# EAGLE design synth-a-phone-v1.0 (EAGLE 5.11)
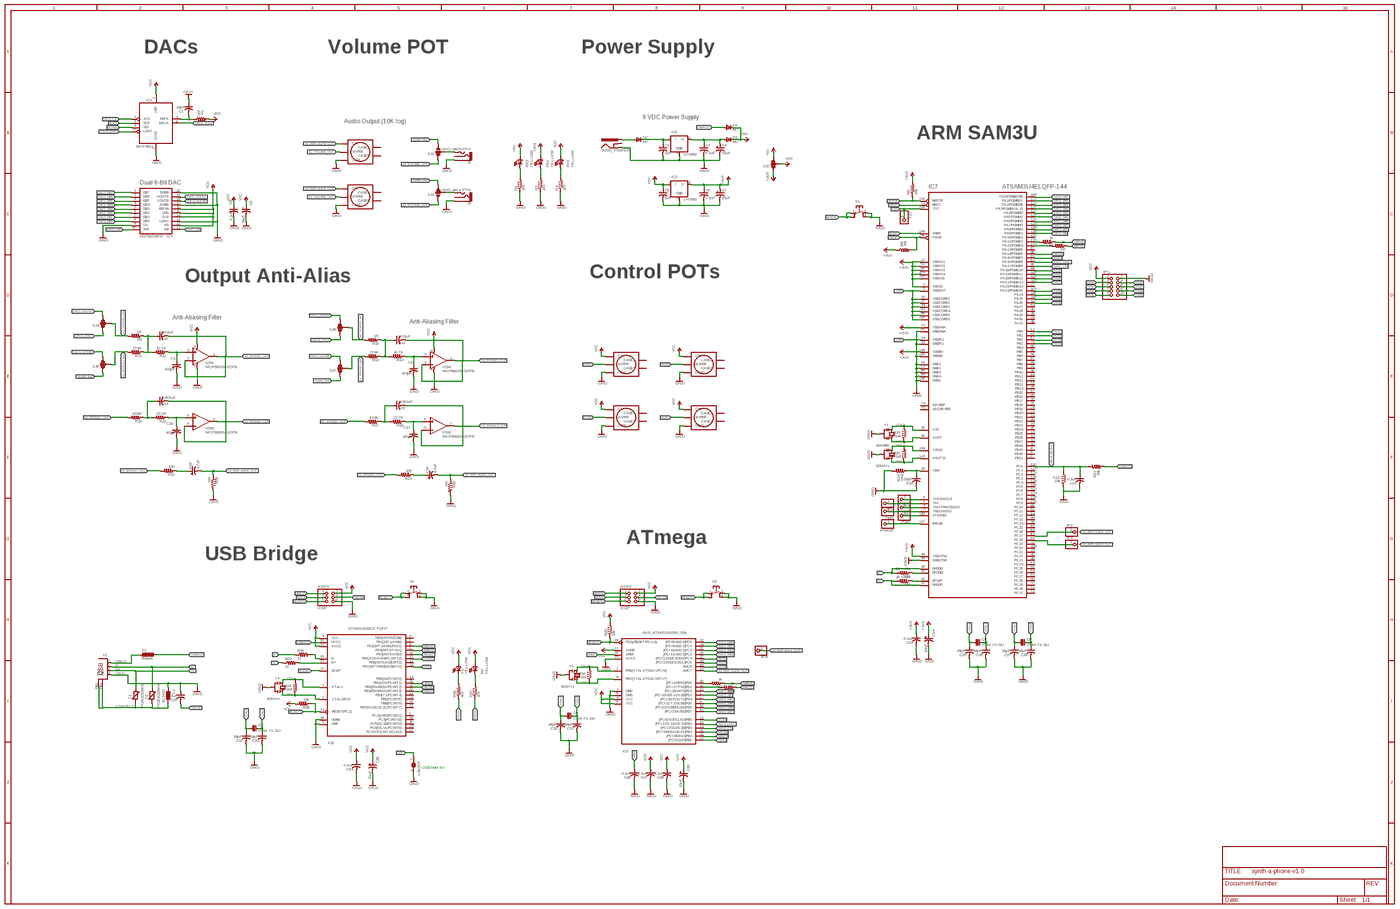
[diagram p0: schematic, sheet 1, overview]
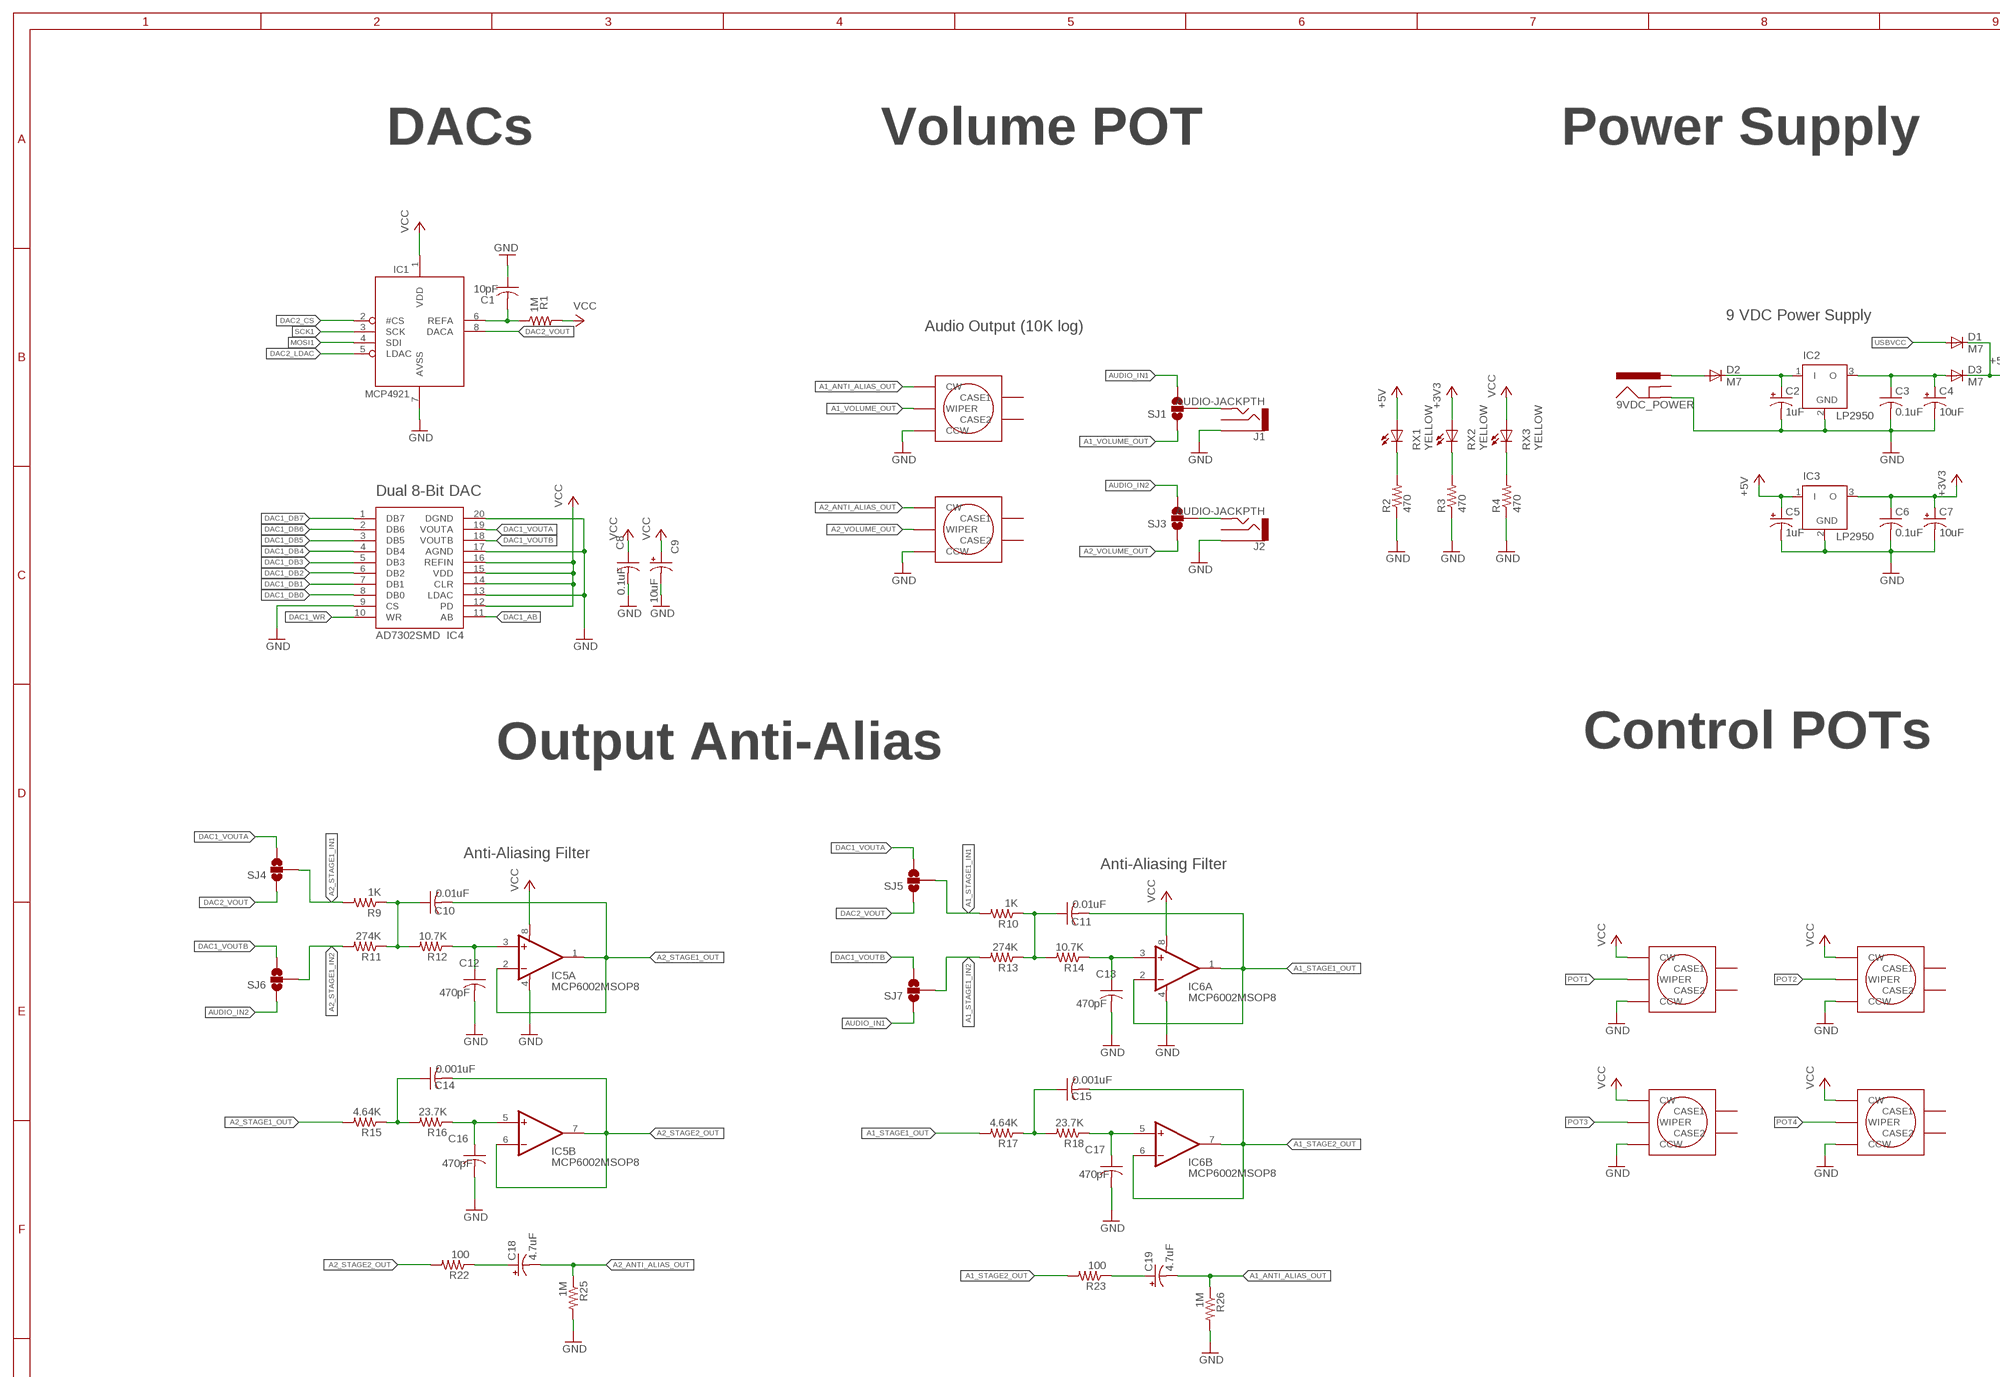
[diagram p1: schematic, sheet 1, part 1 of 4]
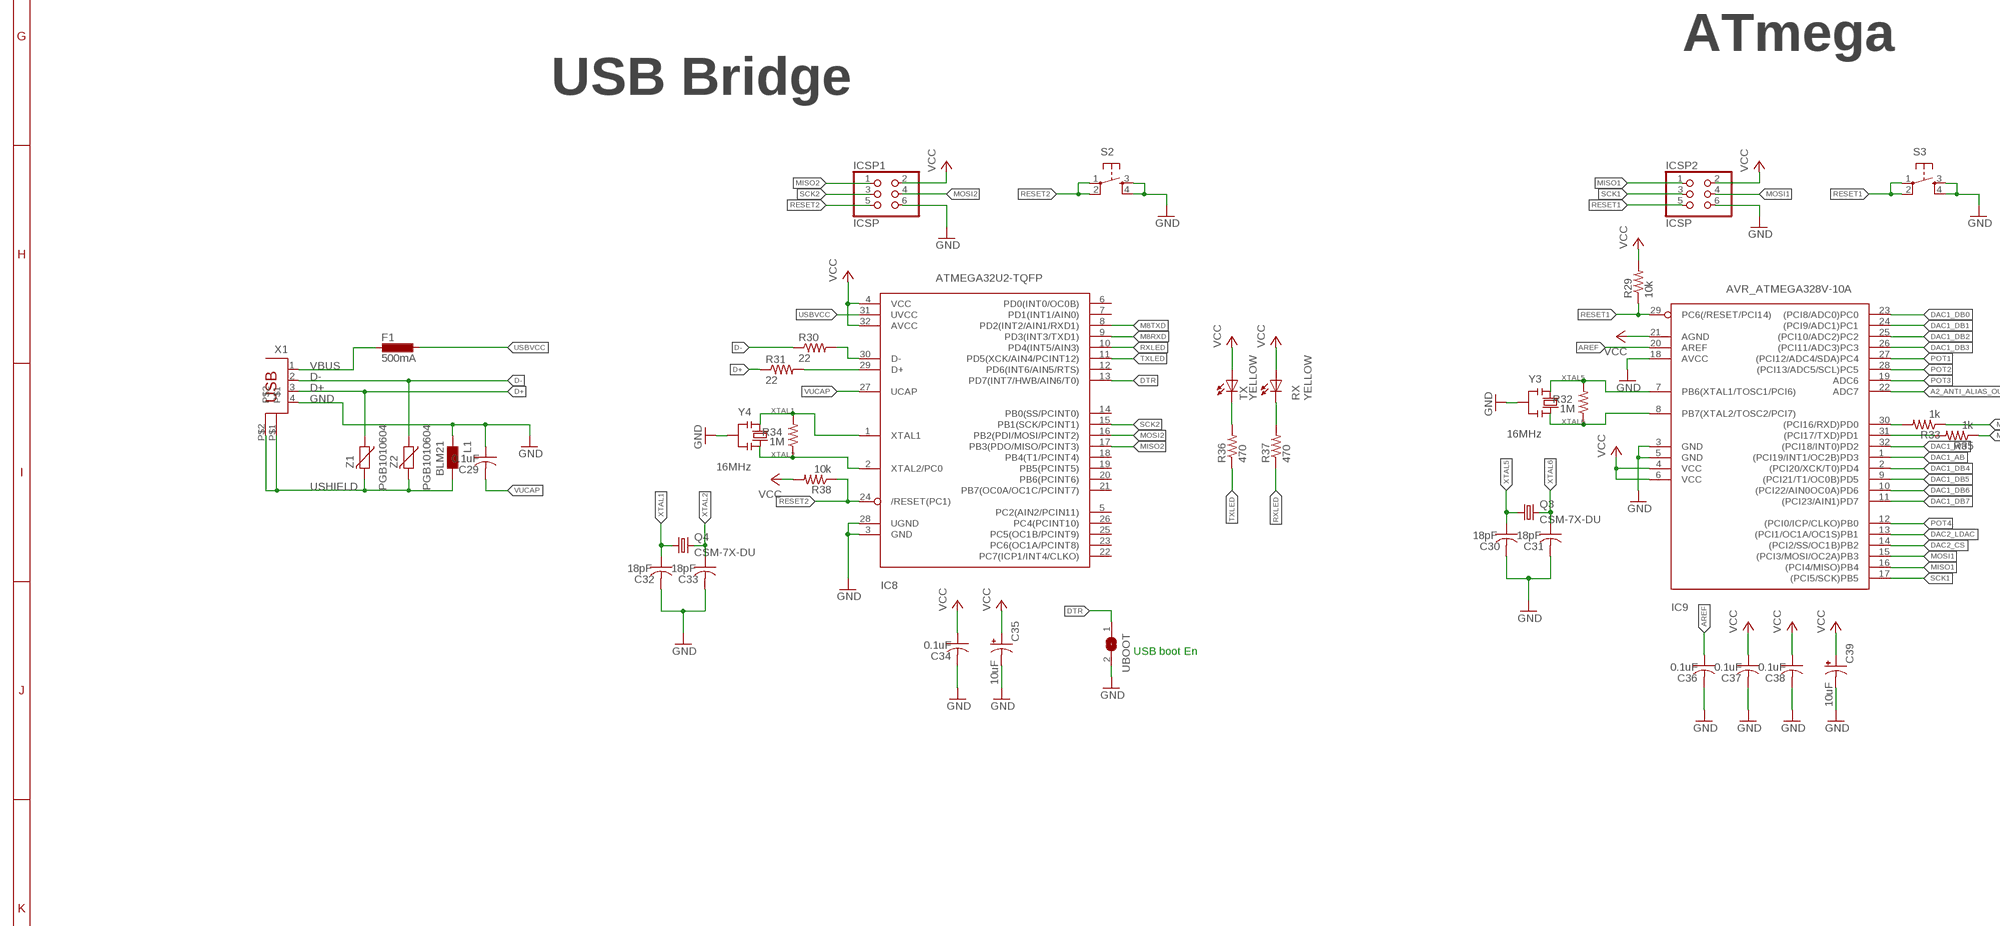
[diagram p2: schematic, sheet 1, part 2 of 4]
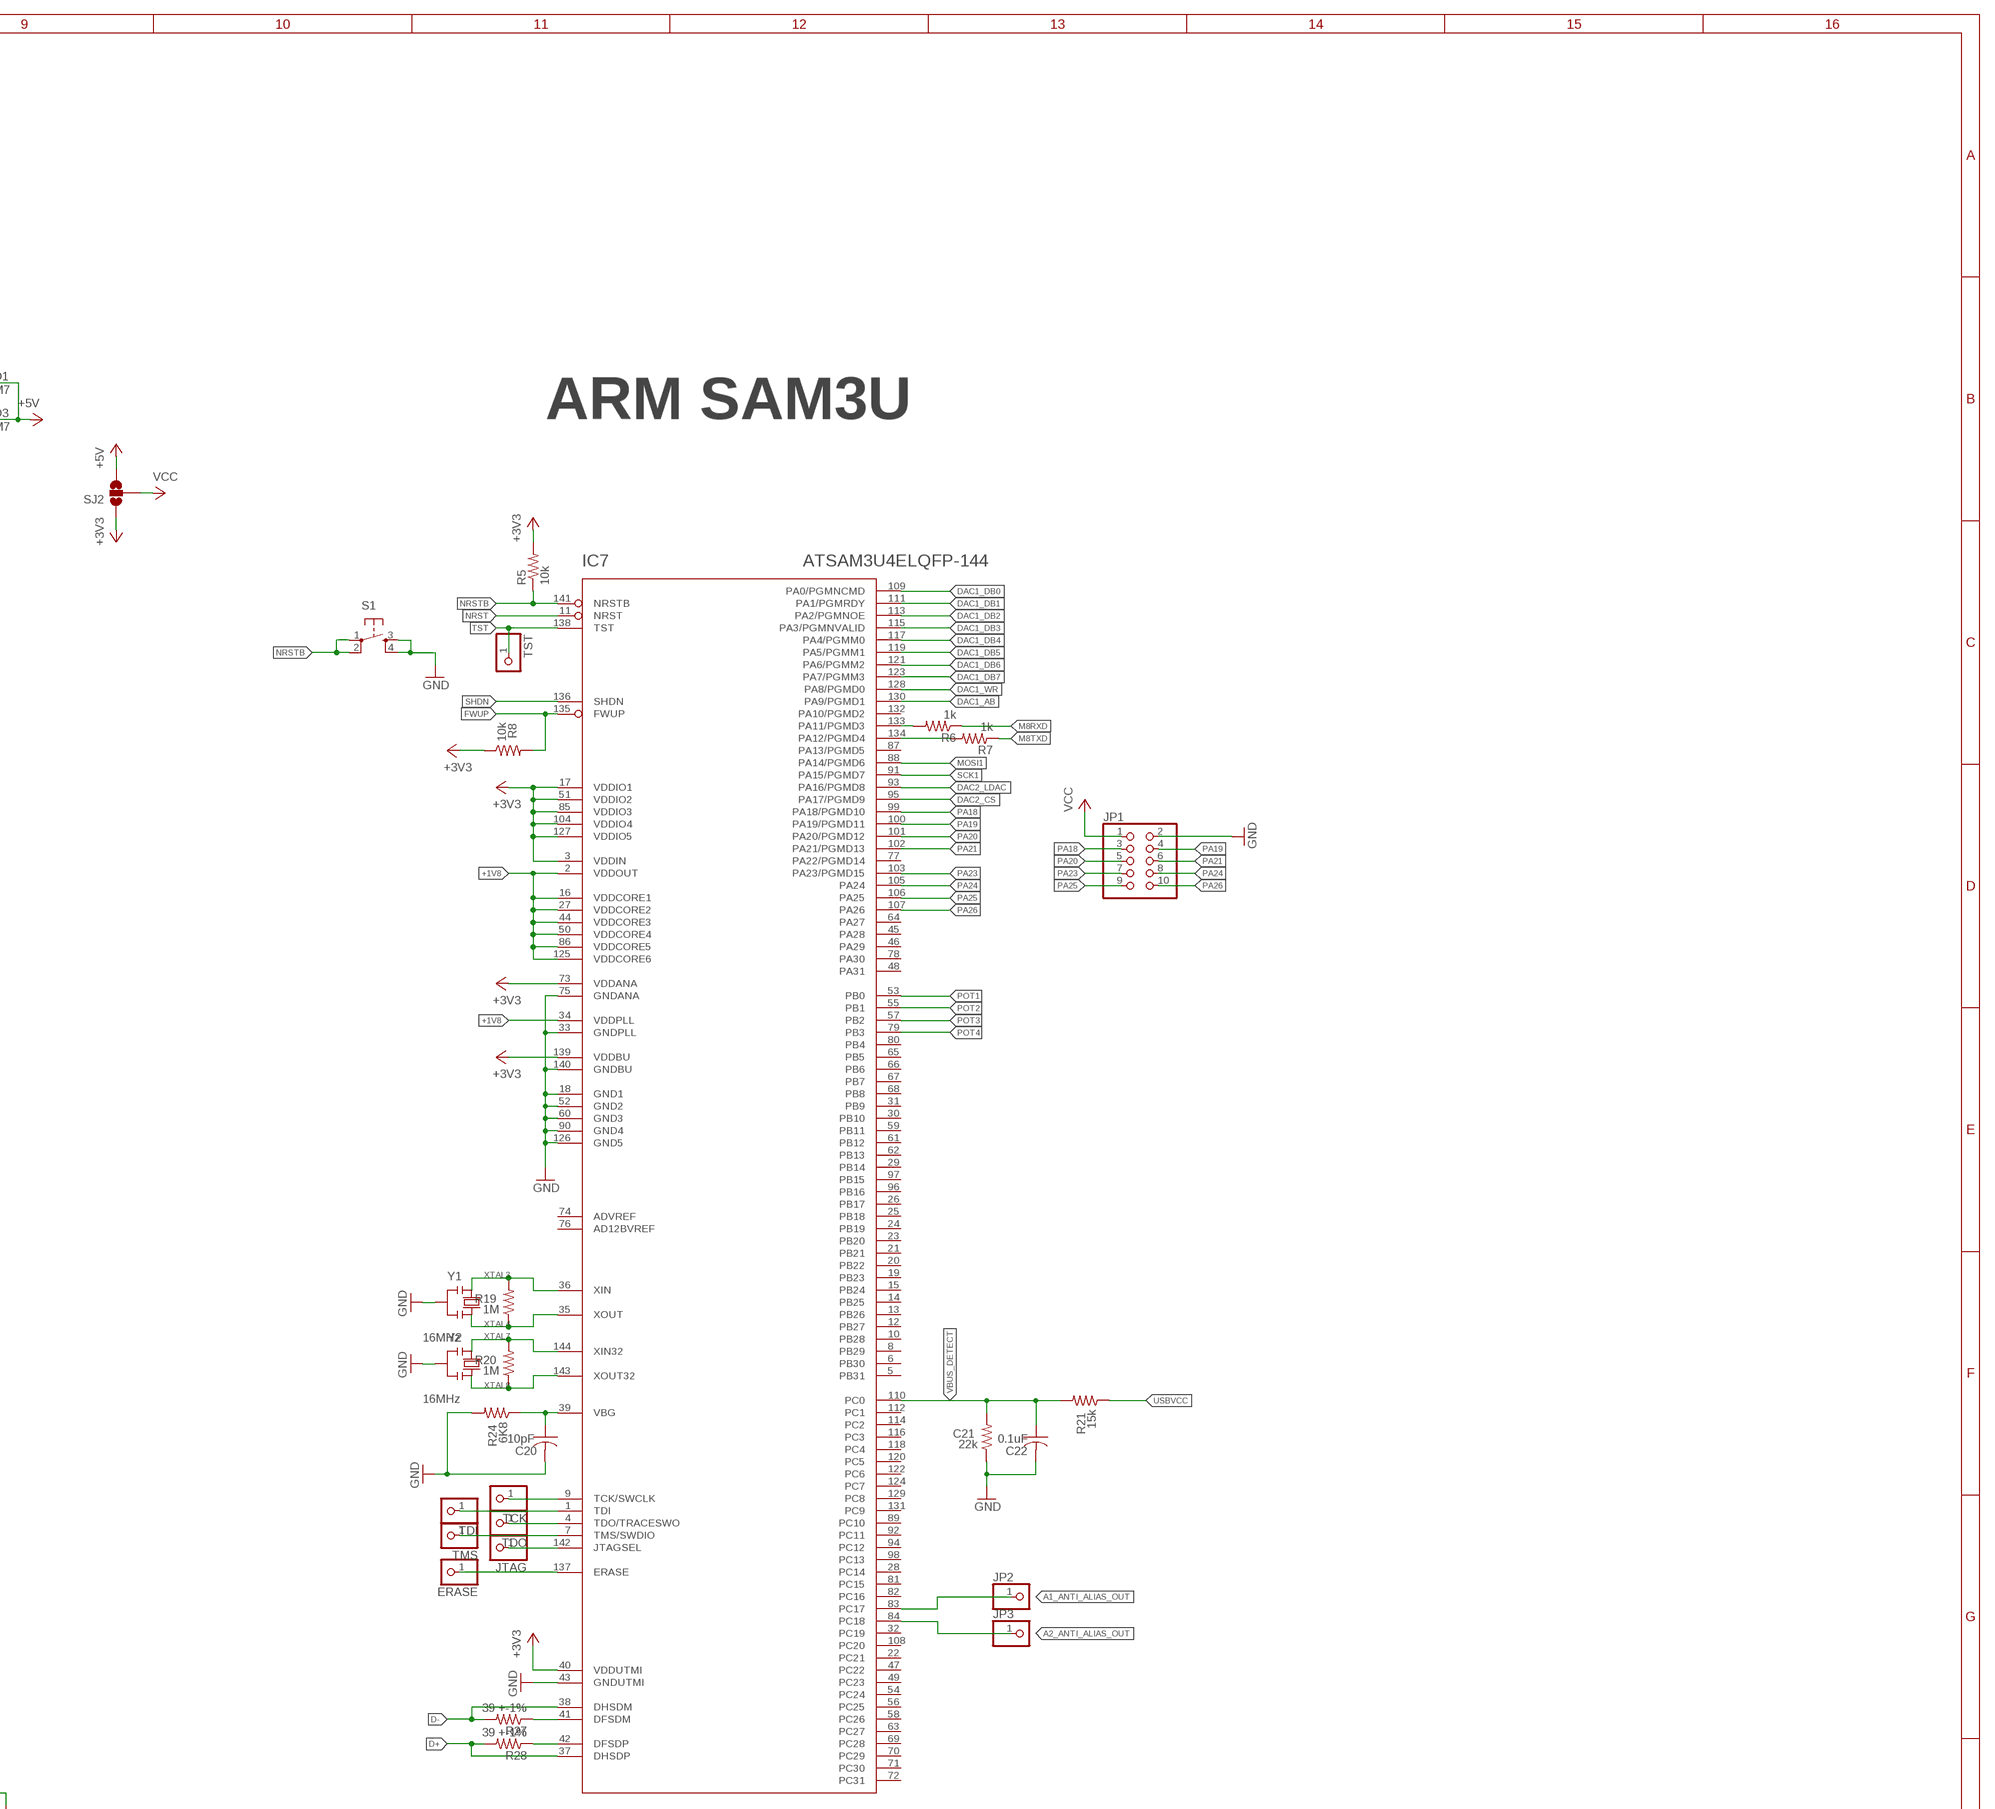
[diagram p3: schematic, sheet 1, part 3 of 4]
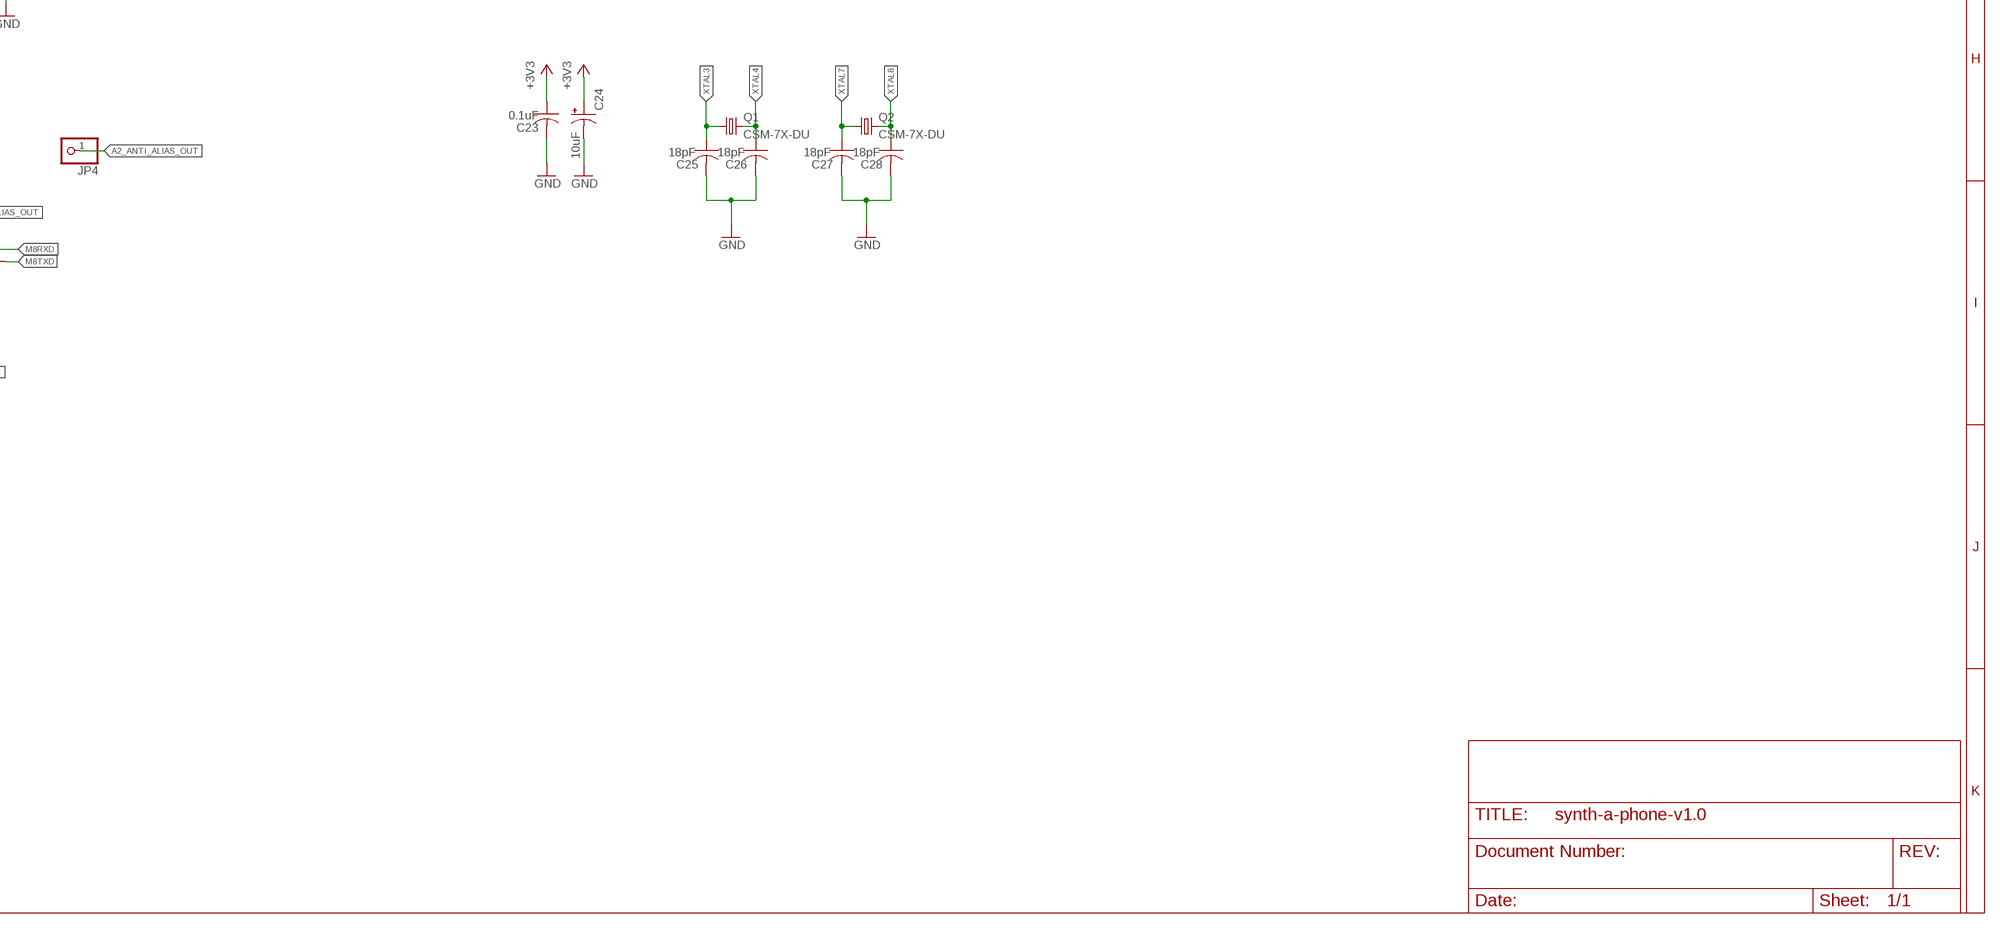
[diagram p4: schematic, sheet 1, part 4 of 4]

## Parts
9VDC_POWER  POWER_JACKPTH  [POWER_JACK_PTH]
C1  10pF  C-USC0603  [C0603]
C2  1uF  CPOL-USSMCA  [SMC_A]
C3  0.1uF  C-USC0603  [C0603]
C4  10uF  CPOL-USSMCA  [SMC_A]
C5  1uF  CPOL-USSMCA  [SMC_A]
C6  0.1uF  C-USC0603  [C0603]
C7  10uF  CPOL-USSMCA  [SMC_A]
C8  0.1uF  C-USC0603  [C0603]
C9  10uF  CPOL-USSMCA  [SMC_A]
C10  0.01uF  C-USC0603  [C0603]
C11  0.01uF  C-USC0603  [C0603]
C12  470pF  C-USC0603  [C0603]
C13  470pF  C-USC0603  [C0603]
C14  0.001uF  C-USC0603  [C0603]
C15  0.001uF  C-USC0603  [C0603]
C16  470pF  C-USC0603  [C0603]
C17  470pF  C-USC0603  [C0603]
C18  4.7uF  CPOL-USSMCA  [SMC_A]
C19  4.7uF  CPOL-USSMCA  [SMC_A]
C20  10pF  C-USC0603  [C0603]
C21  22k  R-US_R0603  [R0603]
C22  0.1uF  C-USC0603  [C0603]
C23  0.1uF  C-USC0603  [C0603]
C24  10uF  CPOL-USSMCA  [SMC_A]
C25  18pF  C-USC0603  [C0603]
C26  18pF  C-USC0603  [C0603]
C27  18pF  C-USC0603  [C0603]
C28  18pF  C-USC0603  [C0603]
C29  0.1uF  C-USC0603  [C0603]
C30  18pF  C-USC0603  [C0603]
C31  18pF  C-USC0603  [C0603]
C32  18pF  C-USC0603  [C0603]
C33  18pF  C-USC0603  [C0603]
C34  0.1uF  C-USC0603  [C0603]
C35  10uF  CPOL-USSMCA  [SMC_A]
C36  0.1uF  C-USC0603  [C0603]
C37  0.1uF  C-USC0603  [C0603]
C38  0.1uF  C-USC0603  [C0603]
C39  10uF  CPOL-USSMCA  [SMC_A]
D1  M7  DIODE-SMB  [SMB]
D2  M7  DIODE-SMB  [SMB]
D3  M7  DIODE-SMB  [SMB]
ERASE  PINHD-1X1  [1X01]
F1  500mA  L-EUL1812  [L1812]
IC1  MCP4921MSOP8  [MSOP8]
IC2  LP2950  [DPACK]
IC3  LP2950  [DPACK]
IC4  AD7302SMD  [TSSOP20]
IC5  MCP6002MSOP8  [MSOP8]
IC6  MCP6002MSOP8  [MSOP8]
IC7  ATSAM3U4ELQFP-144  [SQFP-S-20X20-144]
IC8  ATMEGA32U2-TQFP  [TQFP32-08]
IC9  AVR_ATMEGA328V-10A  [AVR_TQFP32-08]
ICSP1  ICSP  PINHD-2X3  [2X03]
ICSP2  ICSP  PINHD-2X3  [2X03]
J1  AUDIO-JACKPTH  [AUDIO-JACK]
J2  AUDIO-JACKPTH  [AUDIO-JACK]
JP1  PINHD-2X5  [2X05]
JP2  PINHD-1X1  [1X01]
JP3  PINHD-1X1  [1X01]
JP4  PINHD-1X1  [1X01]
JTAG  PINHD-1X1  [1X01]
L1  BLM21  WE-CBF_0805  [0805]
POT1  Volume  VACOLOCO_EVUFRK09_POT  [VACOLOCO_EVUF]
POT2  Volume  VACOLOCO_EVUFRK09_POT  [VACOLOCO_EVUF]
POT3  Volume  VACOLOCO_EVUFRK09_POT  [VACOLOCO_EVUF]
POT4  Volume  VACOLOCO_EVUFRK09_POT  [VACOLOCO_EVUF]
Q1  CSM-7X-DU  [CSM-7X-DU]
Q2  CSM-7X-DU  [CSM-7X-DU]
Q3  CSM-7X-DU  [CSM-7X-DU]
Q4  CSM-7X-DU  [CSM-7X-DU]
R1  1M  R-US_R0603  [R0603]
R2  470  R-US_R0603  [R0603]
R3  470  R-US_R0603  [R0603]
R4  470  R-US_R0603  [R0603]
R5  10k  R-US_R0603  [R0603]
R6  1k  R-US_R0603  [R0603]
R7  1k  R-US_R0603  [R0603]
R8  10k  R-US_R0603  [R0603]
R9  1K  R-US_R0603  [R0603]
R10  1K  R-US_R0603  [R0603]
R11  274K  R-US_R0603  [R0603]
R12  10.7K  R-US_R0603  [R0603]
R13  274K  R-US_R0603  [R0603]
R14  10.7K  R-US_R0603  [R0603]
R15  4.64K  R-US_R0603  [R0603]
R16  23.7K  R-US_R0603  [R0603]
R17  4.64K  R-US_R0603  [R0603]
R18  23.7K  R-US_R0603  [R0603]
R19  1M  R-US_R0603  [R0603]
R20  1M  R-US_R0603  [R0603]
R21  15k  R-US_R0603  [R0603]
R22  100  R-US_R0603  [R0603]
R23  100  R-US_R0603  [R0603]
R24  6K8  R-US_R0603  [R0603]
R25  1M  R-US_R0603  [R0603]
R26  1M  R-US_R0603  [R0603]
R27  39 +-1%  R-US_R0603  [R0603]
R28  39 +-1%  R-US_R0603  [R0603]
R29  10k  R-US_R0603  [R0603]
R30  22  R-US_R0603  [R0603]
R31  22  R-US_R0603  [R0603]
R32  1M  R-US_R0603  [R0603]
R33  1k  R-US_R0603  [R0603]
R34  1M  R-US_R0603  [R0603]
R35  1k  R-US_R0603  [R0603]
R36  470  R-US_R0603  [R0603]
R37  470  R-US_R0603  [R0603]
R38  10k  R-US_R0603  [R0603]
RX  YELLOW  LEDCHIP-LED0805  [CHIP-LED0805]
RX1  YELLOW  LEDCHIP-LED0805  [CHIP-LED0805]
RX2  YELLOW  LEDCHIP-LED0805  [CHIP-LED0805]
RX3  YELLOW  LEDCHIP-LED0805  [CHIP-LED0805]
S1  TAC_SWITCHPTH  [TACTILE-PTH]
S2  TAC_SWITCHPTH  [TACTILE-PTH]
S3  TAC_SWITCHPTH  [TACTILE-PTH]
SJ1  SOLDERJUMPER_2WAYS  [SJ_3]
SJ2  SOLDERJUMPER_2WAYS  [SJ_3]
SJ3  SOLDERJUMPER_2WAYS  [SJ_3]
SJ4  SOLDERJUMPER_2WAYS  [SJ_3]
SJ5  SOLDERJUMPER_2WAYS  [SJ_3]
SJ6  SOLDERJUMPER_2WAYS  [SJ_3]
SJ7  SOLDERJUMPER_2WAYS  [SJ_3]
TCK  PINHD-1X1  [1X01]
TDI  PINHD-1X1  [1X01]
TDO  PINHD-1X1  [1X01]
TMS  PINHD-1X1  [1X01]
TST  PINHD-1X1  [1X01]
TX  YELLOW  LEDCHIP-LED0805  [CHIP-LED0805]
UBOOT  SJ  [SJ]
VOL1  Volume  VACOLOCO_EVUFRK09_POT  [VACOLOCO_EVUF]
VOL2  Volume  VACOLOCO_EVUFRK09_POT  [VACOLOCO_EVUF]
X1  PN61729  [PN61729]
Y1  16MHz  RESONATORMU  [RESONATOR]
Y2  16MHz  RESONATORMU  [RESONATOR]
Y3  16MHz  RESONATORMU  [RESONATOR]
Y4  16MHz  RESONATORMU  [RESONATOR]
Z1  PGB1010604  VARISTORCN0603  [CT/CN0603]
Z2  PGB1010604  VARISTORCN0603  [CT/CN0603]

## Nets
+1V8: IC7.2(VDDOUT) IC7.16(VDDCORE1) IC7.27(VDDCORE2) IC7.34(VDDPLL) IC7.44(VDDCORE3) IC7.50(VDDCORE4) IC7.86(VDDCORE5) IC7.125(VDDCORE6)
+3V3: C6.1 C7.+ C23.1 C24.+ IC3.3(O) IC7.3(VDDIN) IC7.17(VDDIO1) IC7.40(VDDUTMI) IC7.51(VDDIO2) IC7.73(VDDANA) IC7.85(VDDIO3) IC7.104(VDDIO4) IC7.127(VDDIO5) IC7.139(VDDBU) R5.2 R8.1 RX2.A SJ2.1
+5V: C5.+ D1.C D3.C IC3.1(I) RX1.A SJ2.3
A1_ANTI_ALIAS_OUT: C19.- IC7.83(PC17) JP2.1 R26.1 VOL1.CW
A1_STAGE1_IN1: R10.2 SJ5.2
A1_STAGE1_IN2: R13.2 SJ7.2
A1_STAGE1_OUT: C11.2 IC6.1(A:OUT) IC6.2(A:-IN) R17.2
A1_STAGE2_OUT: C15.2 IC6.6(B:-IN) IC6.7(B:OUT) R23.2
A1_VOLUME_OUT: SJ1.1 VOL1.WIPER
A2_ANTI_ALIAS_OUT: C18.- IC7.84(PC18) IC9.22(ADC7) JP3.1 JP4.1 R25.1 VOL2.CW
A2_STAGE1_IN1: R9.2 SJ4.2
A2_STAGE1_IN2: R11.2 SJ6.2
A2_STAGE1_OUT: C10.2 IC5.1(A:OUT) IC5.2(A:-IN) R15.2
A2_STAGE2_OUT: C14.2 IC5.6(B:-IN) IC5.7(B:OUT) R22.2
A2_VOLUME_OUT: SJ3.1 VOL2.WIPER
AREF: C36.1 IC9.20(AREF)
AUDIO_IN1: SJ1.3 SJ7.1
AUDIO_IN2: SJ3.3 SJ6.1
D+: IC7.37(DHSDP) R28.2 R31.1 X1.3 Z1.1
D-: IC7.38(DHSDM) R27.2 R30.1 X1.2 Z2.1
DAC1_AB: IC4.11(AB) IC7.130(PA9/PGMD1) IC9.1((PCI19/INT1/OC2B)PD3)
DAC1_DB0: IC4.8(DB0) IC7.109(PA0/PGMNCMD) IC9.23((PCI8/ADC0)PC0)
DAC1_DB1: IC4.7(DB1) IC7.111(PA1/PGMRDY) IC9.24((PCI9/ADC1)PC1)
DAC1_DB2: IC4.6(DB2) IC7.113(PA2/PGMNOE) IC9.25((PCI10/ADC2)PC2)
DAC1_DB3: IC4.5(DB3) IC7.115(PA3/PGMNVALID) IC9.26((PCI11/ADC3)PC3)
DAC1_DB4: IC4.4(DB4) IC7.117(PA4/PGMM0) IC9.2((PCI20/XCK/T0)PD4)
DAC1_DB5: IC4.3(DB5) IC7.119(PA5/PGMM1) IC9.9((PCI21/T1/OC0B)PD5)
DAC1_DB6: IC4.2(DB6) IC7.121(PA6/PGMM2) IC9.10((PCI22/AIN0OC0A)PD6)
DAC1_DB7: IC4.1(DB7) IC7.123(PA7/PGMM3) IC9.11((PCI23/AIN1)PD7)
DAC1_VOUTA: IC4.19(VOUTA) SJ4.3 SJ5.3
DAC1_VOUTB: IC4.18(VOUTB) SJ6.3 SJ7.3
DAC1_WR: IC4.10(WR) IC7.128(PA8/PGMD0) IC9.32((PCI18/INT0)PD2)
DAC2_CS: IC1.2(#CS) IC7.95(PA17/PGMD9) IC9.14((PCI2/SS/OC1B)PB2)
DAC2_LDAC: IC1.5(LDAC) IC7.93(PA16/PGMD8) IC9.13((PCI1/OC1A/OC1S)PB1)
DAC2_VOUT: IC1.8(DACA) SJ4.1 SJ5.1
DTR: IC8.13(PD7(INT7/HWB/AIN6/T0)) UBOOT.1
FWUP: IC7.135(FWUP) R8.2
GND: 9VDC_POWER.GND C1.1 C2.- C3.2 C4.- C5.- C6.2 C7.- C8.2 C9.- C12.2 C13.2 C16.2 C17.2 C20.2 C21.1 C22.2 C23.2 C24.- C25.2 C26.2 C27.2 C28.2 C29.1 C30.2 C31.2 C32.2 C33.2 C34.2 C35.- C36.2 C37.2 C38.2 C39.- IC1.7(AVSS) IC2.2(GND) IC3.2(GND) IC4.9(CS) IC4.13(LDAC) IC4.17(AGND) IC4.20(DGND) IC5.4(A:V-) IC6.4(A:V-) IC7.18(GND1) IC7.33(GNDPLL) IC7.43(GNDUTMI) IC7.52(GND2) IC7.60(GND3) IC7.75(GNDANA) IC7.90(GND4) IC7.126(GND5) IC7.140(GNDBU) IC8.3(GND) IC8.28(UGND) IC9.3(GND) IC9.5(GND) IC9.18(AVCC) ICSP1.6 ICSP2.6 J1.1 J2.1 JP1.2 L1.1 POT1.CCW POT2.CCW POT3.CCW POT4.CCW R2.1 R3.1 R4.1 R24.2 R25.2 R26.2 S1.3 S1.4 S2.3 S2.4 S3.3 S3.4 UBOOT.2 VOL1.CCW VOL2.CCW X1.4 Y1.2 Y2.2 Y3.2 Y4.2
IC6: C1.2 IC1.6(REFA) R1.1
M8RXD: IC8.9(PD3(INT3/TXD1)) R6.1 R33.1
M8TXD: IC8.8(PD2(INT2/AIN1/RXD1)) R7.1 R35.1
MISO1: IC9.16((PCI4/MISO)PB4) ICSP2.1
MISO2: IC8.17(PB3(PDO/MISO/PCINT3)) ICSP1.1
MOSI1: IC1.4(SDI) IC7.88(PA14/PGMD6) IC9.15((PCI3/MOSI/OC2A)PB3) ICSP2.4
MOSI2: IC8.16(PB2(PDI/MOSI/PCINT2)) ICSP1.4
N$1: IC7.41(DFSDM) R27.1
N$2: IC7.42(DFSDP) R28.1
N$3: R37.2 RX.C
N$4: R36.2 TX.C
N$5: C20.1 IC7.39(VBG) R24.1
N$6: R2.2 RX1.C
N$7: IC7.133(PA11/PGMD3) R6.2
N$8: IC9.30((PCI16/RXD)PD0) R33.2
N$9: IC9.31((PCI17/TXD)PD1) R35.2
N$10: IC7.134(PA12/PGMD4) R7.2
N$11: C3.1 C4.+ D3.A IC2.3(O)
N$12: IC7.9(TCK/SWCLK) TCK.1
N$14: IC7.4(TDO/TRACESWO) TDO.1
N$15: R3.2 RX2.C
N$17: R4.2 RX3.C
N$18: C10.1 R9.1 R11.1 R12.2
N$19: C12.1 IC5.3(A:+IN) R12.1
N$20: C14.1 R15.1 R16.2
N$21: C19.+ R23.1
N$22: C16.1 IC5.5(B:+IN) R16.1
N$23: C18.+ R22.1
N$24: IC7.142(JTAGSEL) JTAG.1
N$25: 9VDC_POWER.PWR D2.A
N$26: J2.5 SJ3.2
N$27: C2.+ D2.C IC2.1(I)
N$28: ERASE.1 IC7.137(ERASE)
N$29: J1.5 SJ1.2
N$69: C11.1 R10.1 R13.1 R14.2
N$71: C13.1 IC6.3(A:+IN) R14.1
N$73: C15.1 R17.1 R18.2
N$74: C17.1 IC6.5(B:+IN) R18.1
NRST: IC7.11(NRST)
NRSTB: IC7.141(NRSTB) R5.1 S1.1 S1.2
PA18: IC7.99(PA18/PGMD10) JP1.3
PA19: IC7.100(PA19/PGMD11) JP1.4
PA20: IC7.101(PA20/PGMD12) JP1.5
PA21: IC7.102(PA21/PGMD13) JP1.6
PA23: IC7.103(PA23/PGMD15) JP1.7
PA24: IC7.105(PA24) JP1.8
PA25: IC7.106(PA25) JP1.9
PA26: IC7.107(PA26) JP1.10
POT1: IC7.53(PB0) IC9.27((PCI12/ADC4/SDA)PC4) POT1.WIPER
POT2: IC7.55(PB1) IC9.28((PCI13/ADC5/SCL)PC5) POT2.WIPER
POT3: IC7.57(PB2) IC9.19(ADC6) POT3.WIPER
POT4: IC7.79(PB3) IC9.12((PCI0/ICP/CLKO)PB0) POT4.WIPER
RD+: IC8.29(D+) R31.2
RD-: IC8.30(D-) R30.2
RESET1: IC9.29(PC6(/RESET/PCI14)) ICSP2.5 R29.1 S3.1 S3.2
RESET2: IC8.24(/RESET(PC1)) ICSP1.5 R38.1 S2.1 S2.2
RXLED: IC8.10(PD4(INT5/AIN3)) R37.1
SCK1: IC1.3(SCK) IC7.91(PA15/PGMD7) IC9.17((PCI5/SCK)PB5) ICSP2.3
SCK2: IC8.15(PB1(SCK/PCINT1)) ICSP1.3
SHDN: IC7.136(SHDN)
TDI: IC7.1(TDI) TDI.1
TMS: IC7.7(TMS/SWDIO) TMS.1
TST: IC7.138(TST) TST.1
TXLED: IC8.11(PD5(XCK/AIN4/PCINT12)) R36.1
USBVCC: D1.A F1.1 IC8.31(UVCC) R21.1
USHIELD: L1.2 X1.P$1 X1.P$2 Z1.2 Z2.2
VBUS: F1.2 X1.1
VBUS_DETECT: C21.2 C22.1 IC7.110(PC0) R21.2
VCC: C8.1 C9.+ C34.1 C35.+ C37.1 C38.1 C39.+ IC1.1(VDD) IC4.12(PD) IC4.14(CLR) IC4.15(VDD) IC4.16(REFIN) IC5.8(A:V+) IC6.8(A:V+) IC8.4(VCC) IC8.32(AVCC) IC9.4(VCC) IC9.6(VCC) IC9.21(AGND) ICSP1.2 ICSP2.2 JP1.1 POT1.CW POT2.CW POT3.CW POT4.CW R1.2 R29.2 R38.2 RX3.A RX.A SJ2.2 TX.A
VUCAP: C29.2 IC8.27(UCAP)
XTAL1: C32.1 IC8.1(XTAL1) Q4.1 R34.2 Y4.1
XTAL2: C33.1 IC8.2(XTAL2/PC0) Q4.2 R34.1 Y4.3
XTAL3: C25.1 IC7.36(XIN) Q1.1 R19.2 Y1.1
XTAL4: C26.1 IC7.35(XOUT) Q1.2 R19.1 Y1.3
XTAL5: C30.1 IC9.7(PB6(XTAL1/TOSC1/PCI6)) Q3.1 R32.2 Y3.1
XTAL6: C31.1 IC9.8(PB7(XTAL2/TOSC2/PCI7)) Q3.2 R32.1 Y3.3
XTAL7: C27.1 IC7.144(XIN32) Q2.1 R20.2 Y2.1
XTAL8: C28.1 IC7.143(XOUT32) Q2.2 R20.1 Y2.3
Unconnected: 9VDC_POWER.GNDBREAK IC7.5(PB31) IC7.6(PB30) IC7.8(PB29) IC7.10(PB28) IC7.12(PB27) IC7.13(PB26) IC7.14(PB25) IC7.15(PB24) IC7.19(PB23) IC7.20(PB22) IC7.21(PB21) IC7.22(PC21) IC7.23(PB20) IC7.24(PB19) IC7.25(PB18) IC7.26(PB17) IC7.28(PC14) IC7.29(PB14) IC7.30(PB10) IC7.31(PB9) IC7.32(PC19) IC7.45(PA28) IC7.46(PA29) IC7.47(PC22) IC7.48(PA31) IC7.49(PC23) IC7.54(PC24) IC7.56(PC25) IC7.58(PC26) IC7.59(PB11) IC7.61(PB12) IC7.62(PB13) IC7.63(PC27) IC7.64(PA27) IC7.65(PB5) IC7.66(PB6) IC7.67(PB7) IC7.68(PB8) IC7.69(PC28) IC7.70(PC29) IC7.71(PC30) IC7.72(PC31) IC7.74(ADVREF) IC7.76(AD12BVREF) IC7.77(PA22/PGMD14) IC7.78(PA30) IC7.80(PB4) IC7.81(PC15) IC7.82(PC16) IC7.87(PA13/PGMD5) IC7.89(PC10) IC7.92(PC11) IC7.94(PC12) IC7.96(PB16) IC7.97(PB15) IC7.98(PC13) IC7.108(PC20) IC7.112(PC1) IC7.114(PC2) IC7.116(PC3) IC7.118(PC4) IC7.120(PC5) IC7.122(PC6) IC7.124(PC7) IC7.129(PC8) IC7.131(PC9) IC7.132(PA10/PGMD2) IC8.5(PC2(AIN2/PCIN11)) IC8.6(PD0(INT0/OC0B)) IC8.7(PD1(INT1/AIN0)) IC8.12(PD6(INT6/AIN5/RTS)) IC8.14(PB0(SS/PCINT0)) IC8.18(PB4(T1/PCINT4)) IC8.19(PB5(PCINT5)) IC8.20(PB6(PCINT6)) IC8.21(PB7(OC0A/OC1C/PCINT7)) IC8.22(PC7(ICP1/INT4/CLKO)) IC8.23(PC6(OC1A/PCINT8)) IC8.25(PC5(OC1B/PCINT9)) IC8.26(PC4(PCINT10)) J1.2 J2.2 POT1.CASE1 POT1.CASE2 POT2.CASE1 POT2.CASE2 POT3.CASE1 POT3.CASE2 POT4.CASE1 POT4.CASE2 VOL1.CASE1 VOL1.CASE2 VOL2.CASE1 VOL2.CASE2

## Notes on the sheet
- DACs | Volume POT | Power Supply
- 9 VDC Power Supply
- Audio Output (10K log)
- ARM SAM3U
- Dual 8-Bit DAC
- Output Anti-Alias | Control POTs
- Anti-Aliasing Filter
- Anti-Aliasing Filter
- ATmega
- USB Bridge
- USB boot En

## Library data of the parts
9VDC_POWER = meeblip:POWER_JACK: Power Jack 5.5mm barrel jack for optional 9 VDC power input.
C1 C3 C6 C8 C10-C17 C20 C22 C23 C25-C34 C36-C38 = rcl:C-US: CAPACITOR, American symbol
C2 C4 C5 C7 C9 C18 C19 C24 C35 C39 = rcl:CPOL-US: POLARIZED CAPACITOR, American symbol
C21 R1-R38 = rcl:R-US_: RESISTOR, American symbol
D1-D3 = diode:DIODE-: DIODE
ERASE JP2-JP4 JTAG TCK TDI TDO TMS TST = adafruit:PINHD-1X1: Pin header 1x1 for 0.1" spacing With round pins
F1 = rcl:L-EU: INDUCTOR, European symbol
IC1 = Sparky:MCP4921
IC2 IC3 = linear:LP2950: 100 mA, Low Power Low Dropout Voltage Regulator Source: http://www.onsemi.com/pub/Collateral/LP2950-D.PDF
IC4 = SparkFun:AD7302: AD7302
IC5 IC6 = Sparky:MCP6002: Dual Op Amp
IC7 = Sparky:ATSAM3U4E
IC8 = adafruit:ATMEGA32U2: ATmega32u2 Pin compatible with the atmega8u2, atmega16u2 and atmega32u2 8, 16 or 32 K flash, 1K RAM, 512b EEPROM 8 bit and 16 bit timer (5 PWM total) UART, SPI (no I2C!) USB with 4 endpoints, LUFA compatible 22 I/O lines, analog comparator (no ADC!) Comes with DFU bootloader burned in!
IC9 = avr:AVR_ATMEGA328: MICROCONTROLLER 32 kBytes FLASH 1 kBytes SRAM 512 Bytes EEPROM USART 8-channel 10 bit ADC
ICSP1 ICSP2 = pinhead:PINHD-2X3: PIN HEADER
J1 J2 = SparkFun:AUDIO-JACK: 3.5mm Audio Jack Simple 3.5mm common PCB mount audio jack. SKU: PRT-08032
JP1 = pinhead:PINHD-2X5: PIN HEADER
L1 = wuerth-elektronik:WE-CBF: SMD EMI Suppression Ferrite Beads - excellent anti-EMI properties - low DCR - impedances till 3000 ohms - rated current up to 6 A
POT1-POT4 VOL1 VOL2 = meeblip:VACOLOCO_EVUF: Panasonic EVUF type potentionmeter Vertical Mount
Q1-Q4 = crystal:CSM-7X-DU: SMD CRYSTAL Source: www.ecsxtal.com .. Crystal 3.6864MHz CSM_7X_DU.PDF; OC_FARNELL: unknown; OC_NEWARK: unknown
RX RX1-RX3 TX = led:LED: LED OSRAM: - CHIPLED LG R971, LG N971, LY N971, LG Q971, LY Q971, LO R971, LY R971 LH N974, LH R974 LS Q976, LO Q976, LY Q976 LO Q996 - Hyper CHIPLED LW Q18S LB Q993, LB Q99A, LB R99A - SideLED LS A670, LO A670, LY A670, LG A670, LP A670 LB A673, LV A673, LT A673, LW A673 LH A674 LY A675 LS A676, LA A676, LO A676, LY A676, LW A676 LS A679, LY A679, LG A679 - Hyper Micro SIDELED® LS Y876, LA Y876, LO Y876, LY Y876 LT Y87S - SmartLED LW L88C, LW L88S LB L89C, LB L89S, LG L890 LS L89K, LO L89K, LY L89K LS L896, LA L896, LO L896, LY L896 - TOPLED LS T670, LO T670, LY T670, LG T670, LP T670 LSG T670, LSP T670, LSY T670, LOP T670, LYG T670 LG T671, LOG T671, LSG T671 LB T673, LV T673, LT T673, LW T673 LH T674 LS T676, LA T676, LO T676, LY T676, LB T676, LH T676, LSB T676, LW T676 LB T67C, LV T67C, LT T67C, LS T67K, LO T67K, LY T67K, LW E67C LS E67B, LA E67B, LO E67B, LY E67B, LB E67C, LV E67C, LT E67C LW T67C LS T679, LY T679, LG T679 LS T770, LO T770, LY T770, LG T770, LP T770 LB T773, LV T773, LT T773, LW T773 LH T774 LS E675, LA E675, LY E675, LS T675 LS T776, LA T776, LO T776, LY T776, LB T776 LHGB T686 LT T68C, LB T68C - Hyper Mini TOPLED® LB M676 - Mini TOPLED Santana® LG M470 LS M47K, LO M47K, LY M47K Source: http://www.osram.convergy.de LUXEON: - LUMILED® LXK2-PW12-R00, LXK2-PW12-S00, LXK2-PW14-U00, LXK2-PW14-V00 LXK2-PM12-R00, LXK2-PM12-S00, LXK2-PM14-U00 LXK2-PE12-Q00, LXK2-PE12-R00, LXK2-PE12-S00, LXK2-PE14-T00, LXK2-PE14-U00 LXK2-PB12-K00, LXK2-PB12-L00, LXK2-PB12-M00, LXK2-PB14-N00, LXK2-PB14-P00, LXK2-PB14-Q00 LXK2-PR12-L00, LXK2-PR12-M00, LXK2-PR14-Q00, LXK2-PR14-R00 LXK2-PD12-Q00, LXK2-PD12-R00, LXK2-PD12-S00 LXK2-PH12-R00, LXK2-PH12-S00 LXK2-PL12-P00, LXK2-PL12-Q00, LXK2-PL12-R00 Source: www.luxeon.com KINGBRIGHT: KA-3528ASYC Source: www.kingbright.com
S1-S3 = SparkFun:TAC_SWITCH: Momentary Switch Button commonly used for reset or general input. Spark Fun Electronics SKU : COM-00097
SJ1-SJ7 = SparkFun:SOLDERJUMPER_2WAY: Solder Jumper 2 way solder jumper
UBOOT = jumper:SJ: SMD solder JUMPER
X1 = SmartPrj:PN61729: BERG USB connector
Y1-Y4 = SmartPrj:RESONATOR
Z1 Z2 = varistor:VARISTOR: VARISTOR

## Board
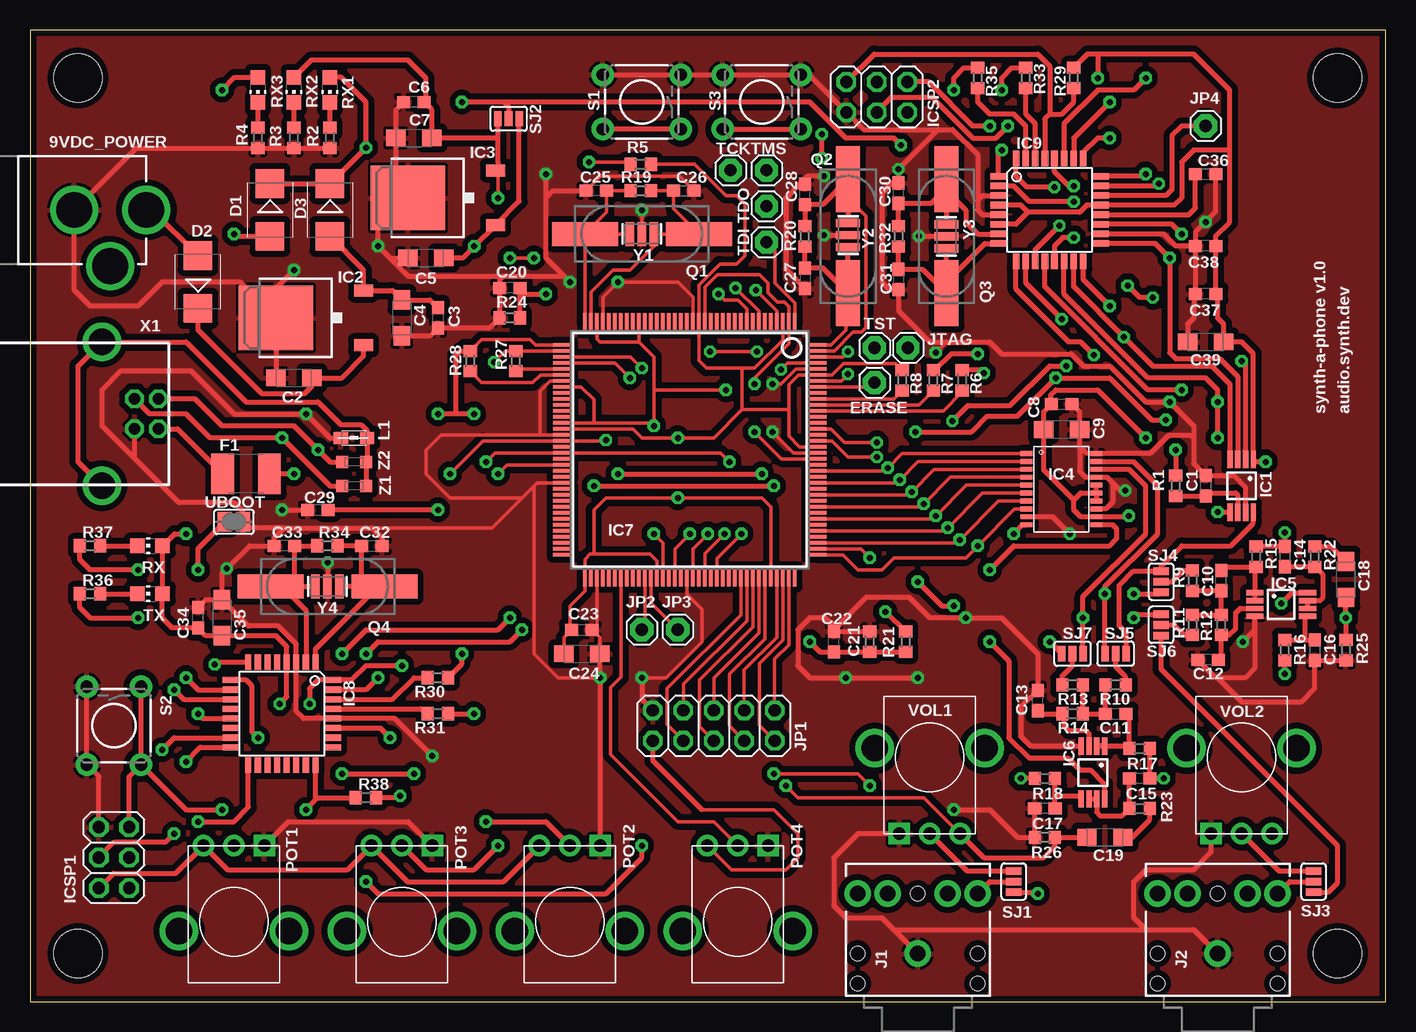
[diagram p5: board, top side]
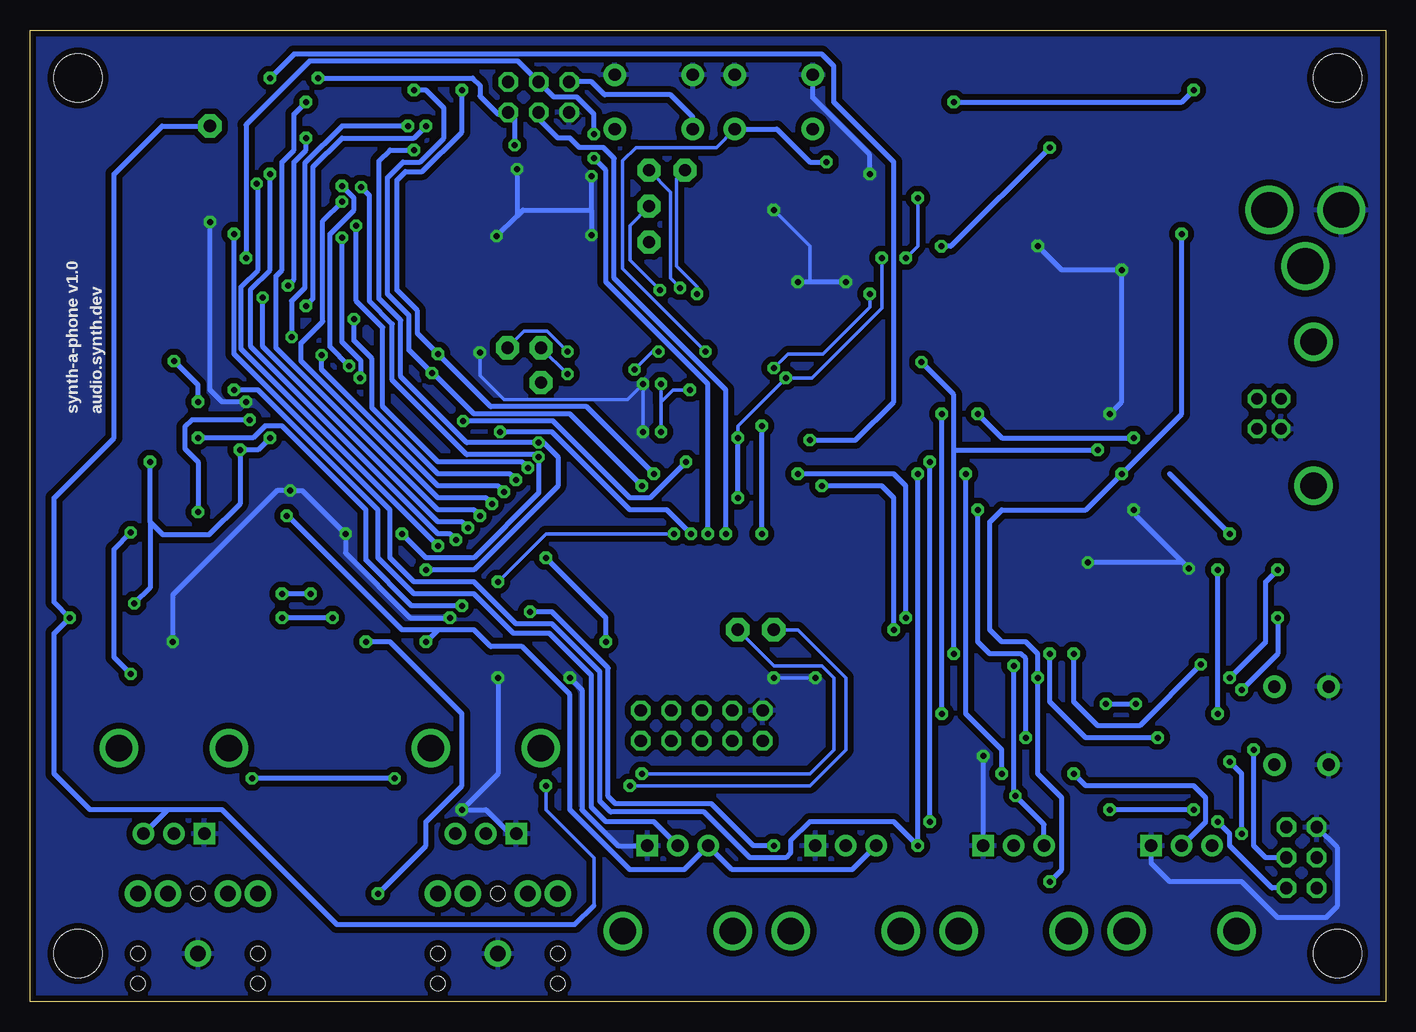
[diagram p6: board, bottom side, seen from below]

Size 113 x 81 mm. Coordinates in mm from the lower left corner, seen from the top.
Outline: 0,0 113,0 113,81 0,81 0,0
Copper layers (1*16): Top 0.035mm / dielectric 1.5mm / Bottom 0.035mm
Design rules "APC": minimum track width 7mil, minimum drill 15mil, track to track 7mil, track to pad 7mil, pad to pad 7mil, via to via 7mil, smd to smd 1mil, copper to edge 8mil, drill to drill 8mil, minimum pad ring 12mil, minimum via ring 10mil, stop-mask expansion 4mil, vias tented up to drill 25mil, thermal gap 10mil
Holes 4 mm at 109,77 109,4 4,4 4,77

### Footprints (pad centres in the part's own frame; a part is rotated, then mirrored left to right if it is on the bottom)
POWER_JACK_PTH = drill 2.997 round: GND 0,7.7; GNDBREAK 4.7,10.7; PWR 0,13.7
C0603 = smd 1.1 x 1: 1 -0.85,0; 2 0.85,0
SMC_A = smd 1.6 x 1.4: + -1.5,0; - 1.5,0
R0603 = smd 1 x 1.1: 1 -0.85,0; 2 0.85,0
SMB = smd 2.4 x 2.4: A 2.2,0; C -2.2,0
1X01 = drill 1.016 pad 1.93 octagon: 1 0,0
L1812 = smd 1.9 x 3.4: 1 -1.95,0; 2 1.95,0
MSOP8 = smd 1.45 x 0.45: 1 -2.2,0.975; 2 -2.2,0.325; 3 -2.2,-0.325; 4 -2.2,-0.975; 5 2.2,-0.975; 6 2.2,-0.325; 7 2.2,0.325; 8 2.2,0.975
DPACK = smd 1 x 1.6: 1 -2.28,-4.8; 3 2.28,-4.8 | smd 5.4 x 6.2: 2 0,2.5
TSSOP20 = smd 1 x 0.4: 1 -2.937,2.693; 2 -2.937,2.032; 3 -2.937,1.372; 4 -2.937,0.712; 5 -2.937,0.051; 6 -2.937,-0.609; 7 -2.937,-1.27; 8 -2.943,-1.93; 9 -2.937,-2.59; 10 -2.937,-3.251; 11 2.905,-3.251; 12 2.905,-2.59; 13 2.911,-1.93; 14 2.905,-1.27; 15 2.905,-0.609; 16 2.905,0.051; 17 2.905,0.712; 18 2.905,1.372; 19 2.905,2.032; 20 2.905,2.693
SQFP-S-20X20-144 = smd 0.3 x 1.6: 1 -8.75,-10.6; 2 -8.25,-10.6; 3 -7.75,-10.6; 4 -7.25,-10.6; 5 -6.75,-10.6; 6 -6.25,-10.6; 7 -5.75,-10.6; 8 -5.25,-10.6; 9 -4.75,-10.6; 10 -4.25,-10.6; 11 -3.75,-10.6; 12 -3.25,-10.6; 13 -2.75,-10.6; 14 -2.25,-10.6; 15 -1.75,-10.6; 16 -1.25,-10.6; 17 -0.75,-10.6; 18 -0.25,-10.6; 19 0.25,-10.6; 20 0.75,-10.6; 21 1.25,-10.6; 22 1.75,-10.6; 23 2.25,-10.6; 24 2.75,-10.6; 25 3.25,-10.6; 26 3.75,-10.6; 27 4.25,-10.6; 28 4.75,-10.6; 29 5.25,-10.6; 30 5.75,-10.6; 31 6.25,-10.6; 32 6.75,-10.6; 33 7.25,-10.6; 34 7.75,-10.6; 35 8.25,-10.6; 36 8.75,-10.6; 73 8.75,10.6; 74 8.25,10.6; 75 7.75,10.6; 76 7.25,10.6; 77 6.75,10.6; 78 6.25,10.6; 79 5.75,10.6; 80 5.25,10.6; 81 4.75,10.6; 82 4.25,10.6; 83 3.75,10.6; 84 3.25,10.6; 85 2.75,10.6; 86 2.25,10.6; 87 1.75,10.6; 88 1.25,10.6; 89 0.75,10.6; 90 0.25,10.6; 91 -0.25,10.6; 92 -0.75,10.6; 93 -1.25,10.6; 94 -1.75,10.6; 95 -2.25,10.6; 96 -2.75,10.6; 97 -3.25,10.6; 98 -3.75,10.6; 99 -4.25,10.6; 100 -4.75,10.6; 101 -5.25,10.6; 102 -5.75,10.6; 103 -6.25,10.6; 104 -6.75,10.6; 105 -7.25,10.6; 106 -7.75,10.6; 107 -8.25,10.6; 108 -8.75,10.6 | smd 1.6 x 0.3: 37 10.6,-8.75; 38 10.6,-8.25; 39 10.6,-7.75; 40 10.6,-7.25; 41 10.6,-6.75; 42 10.6,-6.25; 43 10.6,-5.75; 44 10.6,-5.25; 45 10.6,-4.75; 46 10.6,-4.25; 47 10.6,-3.75; 48 10.6,-3.25; 49 10.6,-2.75; 50 10.6,-2.25; 51 10.6,-1.75; 52 10.6,-1.25; 53 10.6,-0.75; 54 10.6,-0.25; 55 10.6,0.25; 56 10.6,0.75; 57 10.6,1.25; 58 10.6,1.75; 59 10.6,2.25; 60 10.6,2.75; 61 10.6,3.25; 62 10.6,3.75; 63 10.6,4.25; 64 10.6,4.75; 65 10.6,5.25; 66 10.6,5.75; 67 10.6,6.25; 68 10.6,6.75; 69 10.6,7.25; 70 10.6,7.75; 71 10.6,8.25; 72 10.6,8.75; 109 -10.6,8.75; 110 -10.6,8.25; 111 -10.6,7.75; 112 -10.6,7.25; 113 -10.6,6.75; 114 -10.6,6.25; 115 -10.6,5.75; 116 -10.6,5.25; 117 -10.6,4.75; 118 -10.6,4.25; 119 -10.6,3.75; 120 -10.6,3.25; 121 -10.6,2.75; 122 -10.6,2.25; 123 -10.6,1.75; 124 -10.6,1.25; 125 -10.6,0.75; 126 -10.6,0.25; 127 -10.6,-0.25; 128 -10.6,-0.75; 129 -10.6,-1.25; 130 -10.6,-1.75; 131 -10.6,-2.25; 132 -10.6,-2.75; 133 -10.6,-3.25; 134 -10.6,-3.75; 135 -10.6,-4.25; 136 -10.6,-4.75; 137 -10.6,-5.25; 138 -10.6,-5.75; 139 -10.6,-6.25; 140 -10.6,-6.75; 141 -10.6,-7.25; 142 -10.6,-7.75; 143 -10.6,-8.25; 144 -10.6,-8.75
TQFP32-08 = smd 1.27 x 0.508: 1 -4.293,2.8; 2 -4.293,2; 3 -4.293,1.2; 4 -4.293,0.4; 5 -4.293,-0.4; 6 -4.293,-1.2; 7 -4.293,-2; 8 -4.293,-2.8; 17 4.293,-2.8; 18 4.293,-2; 19 4.293,-1.2; 20 4.293,-0.4; 21 4.293,0.4; 22 4.293,1.2; 23 4.293,2; 24 4.293,2.8 | smd 0.508 x 1.27: 9 -2.8,-4.293; 10 -2,-4.293; 11 -1.2,-4.293; 12 -0.4,-4.293; 13 0.4,-4.293; 14 1.2,-4.293; 15 2,-4.293; 16 2.8,-4.293; 25 2.8,4.293; 26 2,4.293; 27 1.2,4.293; 28 0.4,4.293; 29 -0.4,4.293; 30 -1.2,4.293; 31 -2,4.293; 32 -2.8,4.293
AVR_TQFP32-08 = smd 1.27 x 0.559: 1 -4.293,2.8; 2 -4.293,2; 3 -4.293,1.2; 4 -4.293,0.4; 5 -4.293,-0.4; 6 -4.293,-1.2; 7 -4.293,-2; 8 -4.293,-2.8; 17 4.293,-2.8; 18 4.293,-2; 19 4.293,-1.2; 20 4.293,-0.4; 21 4.293,0.4; 22 4.293,1.2; 23 4.293,2; 24 4.293,2.8 | smd 0.559 x 1.27: 9 -2.8,-4.293; 10 -2,-4.293; 11 -1.2,-4.293; 12 -0.4,-4.293; 13 0.4,-4.293; 14 1.2,-4.293; 15 2,-4.293; 16 2.8,-4.293; 25 2.8,4.293; 26 2,4.293; 27 1.2,4.293; 28 0.4,4.293; 29 -0.4,4.293; 30 -1.2,4.293; 31 -2,4.293; 32 -2.8,4.293
2X03 = drill 1.016 octagon: 1 -2.54,-1.27; 2 -2.54,1.27; 3 0,-1.27; 4 0,1.27; 5 2.54,-1.27; 6 2.54,1.27
AUDIO-JACK = drill 1.3 pad 2.184 round: 1 0,0; 2 5,5; 3 5,2.5; 4 5,-2.5; 5 5,-5 | hole 1.2: 0,5; -2.5,5; -2.5,-5; 0,-5; 5,0
2X05 = drill 1.016 octagon: 1 -5.08,-1.27; 2 -5.08,1.27; 3 -2.54,-1.27; 4 -2.54,1.27; 5 0,-1.27; 6 0,1.27; 7 2.54,-1.27; 8 2.54,1.27; 9 5.08,-1.27; 10 5.08,1.27
0805 = smd 1.2 x 1: 1 -1.1,0; 2 1.1,0
VACOLOCO_EVUF = drill 2.2 round: CASE1 -4.572,7.112; CASE2 4.572,7.112 | drill 1.016 pad 1.778 square: CCW -2.54,0 | drill 1.016 pad 1.778 round: CW 2.54,0; WIPER 0,0
CSM-7X-DU = smd 5.5 x 2: 1 -4.75,0; 2 4.75,0
CHIP-LED0805 = smd 1.2 x 1.2: A 0,-1.05; C 0,1.05
TACTILE-PTH = drill 1.016 pad 1.88 round: 1 -3.251,2.261; 2 3.251,2.261; 3 -3.251,-2.261; 4 3.251,-2.261
SJ_3 = smd 0.635 x 1.27: 1 -0.889,0; 2 0,0; 3 0.889,0
SJ = smd 1.168 x 1.6: 1 -0.762,0; 2 0.762,0
PN61729 = drill 0.95 octagon: 1 1.25,4.71; 2 -1.25,4.71; 3 -1.25,2.71; 4 1.25,2.71 | drill 2.2 round: P$1 -6,0; P$2 6,0
RESONATOR = smd 0.7 x 2: 1 -1,0; 2 0,0; 3 1,0
CT/CN0603 = smd 1 x 1: 1 -1,0; 2 1,0

### Placement (x,y rotation side)
9VDC_POWER  -4,66 270 top
C1  98,43 270 top
C2  22,52 180 top
C3  34,57 270 top
C4  31,57 270 top
C5  33,62 180 top
C6  32,75 180 top
C7  32,72 180 top
C8  86,49.8 0 top
C9  86,47.7 0 top
C10  99.3,35.1 90 top
C11  90.5,24 0 top
C12  98.2,28.5 180 top
C13  84,25.1 90 top
C14  104.6,37.1 270 top
C15  92.5,18.6 180 top
C16  107.1,29.3 270 top
C17  84.6,16.1 180 top
C18  109.7,35.2 270 top
C19  89.6,13.7 180 top
C20  40,59.5 180 top
C21  70,30 270 top
C22  67,30 90 top
C23  46,31 0 top
C24  46,29 0 top
C25  47.2,67.6 180 top
C26  54.5,67.6 0 top
C27  64.6,60.3 270 top
C28  64.6,67.3 90 top
C29  24,41 0 top
C30  72.4,67.4 90 top
C31  72.4,60.2 270 top
C32  28.5,38 0 top
C33  21.2,38 180 top
C34  14,32 90 top
C35  16,32 90 top
C36  98,69 0 top
C37  98,59 180 top
C38  98,63 180 top
C39  98,55 180 top
D1  20,66 270 top
D2  14,60 90 top
D3  25,66 270 top
ERASE  70.4,51.6 0 top
F1  18,44 180 top
IC1  101,43 270 top
IC2  23,57 90 top
IC3  34,67 90 top
IC4  86,43 0 top
IC5  104.3,33.1 0 top
IC6  88.6,19.1 270 top
IC7  55,46 180 top
IC8  21,24 270 top
IC9  85,66 0 top
ICSP1  7,12 90 top
ICSP2  70.6,75.4 180 top
J1  74,4 90 top
J2  99,4 90 top
JP1  57,23 0 top
JP2  51,31 0 top
JP3  54,31 0 top
JP4  98,73 0 top
JTAG  73.2,54.5 0 top
L1  27,47 0 top
POT1  17,13 180 top
POT2  45,13 180 top
POT3  31,13 180 top
POT4  59,13 180 top
Q1  51,64 0 top
Q2  68.2,63.8 90 top
Q3  76.4,63.8 270 top
Q4  24.8,34.6 180 top
R1  95.5,43 90 top
R2  25,72 90 top
R3  22,72 90 top
R4  19,72 90 top
R5  50.9,69.8 0 top
R6  77.7,51.8 270 top
R7  75.3,51.8 270 top
R8  72.7,51.8 270 top
R9  96.9,35.1 90 top
R10  90.5,26.4 0 top
R11  96.9,31.4 270 top
R12  99.3,31.4 90 top
R13  86.9,26.4 180 top
R14  86.9,24 0 top
R15  102.2,37.1 270 top
R16  104.6,29.3 270 top
R17  92.5,21.1 180 top
R18  84.6,18.6 180 top
R19  50.9,67.6 180 top
R20  64.6,63.8 270 top
R21  73,30 270 top
R22  107.1,37.1 270 top
R23  92.5,16.1 180 top
R24  40,57 180 top
R25  109.7,29.3 270 top
R26  84.6,13.7 180 top
R27  40.5,53.4 90 top
R28  36.7,53.4 90 top
R29  87,77 90 top
R30  34,27 180 top
R31  34,24 180 top
R32  72.4,63.8 90 top
R33  83,77 270 top
R34  24.8,38 0 top
R35  79,77 270 top
R36  5,34 0 top
R37  5,38 0 top
R38  28,17 0 top
RX  10,38 90 top
RX1  25,76 180 top
RX2  22,76 180 top
RX3  19,76 180 top
S1  51,75 180 top
S2  7,23 270 top
S3  61,75 180 top
SJ1  82,10 270 top
SJ2  39.9,73.6 0 top
SJ3  107,10 270 top
SJ4  94.3,35 270 top
SJ5  90.5,29 180 top
SJ6  94.3,31.4 90 top
SJ7  86.9,29 0 top
TCK  58.4,69.3 0 top
TDI  61.4,63.3 0 top
TDO  61.4,66.3 0 top
TMS  61.4,69.3 0 top
TST  70.4,54.5 0 top
TX  10,34 90 top
UBOOT  17,40 0 top
VOL1  75,14 0 top
VOL2  101,14 0 top
X1  6,49 270 top
Y1  51,64 0 top
Y2  68.2,63.9 90 top
Y3  76.4,63.8 270 top
Y4  24.8,34.6 180 top
Z1  27,43 0 top
Z2  27,45 0 top

### Tracks (layer width: path | path; a pad name or v marks a point on that pad's centre or on a via)
+1V8  (via drill 0.5)
  Top 0.305: 47,48.25 51.75,48.25 v52,48 52,51 | 47,48.25 IC7.50 | v52,39 52.75,38.25 IC7.86 | IC7.16 56.25,59.55 57.3,60.6 60.8,60.6 61.5,59.9 61.5,59.1 62.3,58.3 62.9,58.3 63.25,57.95 IC7.2 63.25,54.85 60.4,52 v60.4,51.5 | IC7.44 45.95,51.25 47,50.2 47,48.25 | 50.75,55 IC7.27 | IC7.34 47.25,55.25 47.5,55 50.75,55 | 50.75,55 52,53.75 52,51 | IC7.125 62.65,45.25 v60.4,47.5 | 52,51 v58,51
  Bottom 0.305: 60.4,50 v60.4,47.5 | 60.4,50 v60.4,51.5 | v58,51 59.4,51 60.4,50
  Bottom 0.406: v52,39 v52,48
+3V3  (via drill 0.5)
  Top 0.305: IC7.51 50.25,47.75 51,47 v54,47 57,47 59.33,49.33 | IC7.104 61.75,41.25 61,42 v54,42 48,42 47,41 47,37.3 | IC7.127 64.15,46.25 63.25,47.15 63.25,49.33 | C24.+ 44.5,30.35 C23.1 45,31.15 45,33 46.25,34.25 IC7.73 46.25,36.85 46.7,37.3 47,37.3 | IC7.40 48.75,53.25 v50,52 | IC3.3 39,69.08 | 47,37.3 51.7,37.3 52.25,36.75 IC7.85 | IC7.3 62.75,55.15 60.4,52.8 59.4,52.8 | 59.33,49.33 63.25,49.33 | v42,62 v40,62 | v39,67 39.01,67.01 39.01,70 | R5.2 55.4,69.8 58,67.2 58.9,67.2 59.6,66.5 59.6,62.2 58.9,61.5 57.5,61.5 55.75,59.75 IC7.17 55.75,53.45 56.4,52.8 59.4,52.8 | 59.33,49.33 59.33,52.73 59.4,52.8 | R8.1 72.15,53.2 71,53.2 69.7,53.2 67.8,53.2 66.85,52.25 IC7.139 64.05,52.25 63.25,51.45 63.25,49.33
  Top 0.406: RX2.A 23.45,78.5 31.5,78.5 33,77 33,75.15 C6.1 33.5,74.35 C7.+ 39.01,72 | IC3.3 39.01,69.49 39.01,70 39.01,72 | 39.01,72 SJ2.1
  Bottom 0.305: v54,47 54,48 v50,52 47.8,52 42,57.8 v42,62 | v40,62 39,63 v39,67
  Bottom 0.406: v54,42 v54,47
+5V  (via drill 0.5)
  Top 0.406: RX1.A 25.95,77.05 28,75 v28,71.2 D3.C D1.C | C5.+ 36.08,62 v37.04,62.96 IC3.1 40.79,66.71 SJ2.3
  Bottom 0.406: v28,71.2 36.24,62.96 v37.04,62.96
A1_ANTI_ALIAS_OUT  (via drill 0.5)
  Top 0.305: IC7.83 51.25,31.25 JP2.1 | v63,18 64,17 74.54,17 VOL1.CW
  Top 0.406: C19.- R26.1 85.45,12.95 84.5,12 79.54,12 VOL1.CW
  Bottom 0.305: v63,18 48,18 45,21 45,27 49,31 JP2.1
A1_STAGE1_IN1
  Top 0.406: R10.2 91.35,27.05 90.5,27.9 SJ5.2
A1_STAGE1_IN2
  Top 0.406: R13.2 86.05,27.15 86.9,28 SJ7.2
A1_STAGE1_OUT
  Top 0.406: 89.35,21.3 IC6.2 IC6.1 91.45,21.3 R17.2 91.65,23.7 C11.2
A1_STAGE2_OUT
  Top 0.406: IC6.6 IC6.7 88.92,15.78 89.2,15.5 91.05,15.5 R23.2 C15.2
A1_VOLUME_OUT
  Top 0.406: SJ1.1 78.11,10.89 VOL1.WIPER
A2_ANTI_ALIAS_OUT  (via drill 0.5)
  Top 0.305: IC7.84 51.75,33.25 JP3.1 | v62,19 69,19 v70,18
  Top 0.406: R25.1 v109.7,32 C18.- | JP4.1 96,73 95.2,72.2 95.2,67.7 94.7,67.2 IC9.22
  Bottom 0.305: v62,19 48,19 46,21 46,27 47,28 51,28 JP3.1 | v70,18 70,16 66,12 66,8
  Bottom 0.406: JP4.1 102,73 106,69 106,47 111,42 111,33.3 v109.7,32 111,30.7 111,19 108,16 101.54,16 | 66,8 67.6,6.4 87.4,6.4 97,16 101,16 101.54,16 | 101.54,16 VOL2.CW
A2_STAGE1_IN1
  Top 0.406: R9.2 96.15,35.95 95.2,35 SJ4.2
A2_STAGE1_IN2
  Top 0.406: R11.2 96.25,30.55 95.4,31.4 SJ6.2
A2_STAGE1_OUT
  Top 0.406: C10.2 99.6,36.25 R15.2 102.1,36.15 IC5.1 IC5.2
A2_STAGE2_OUT
  Top 0.406: IC5.6 IC5.7 107.53,33.42 107.8,33.7 107.8,35.55 R22.2 C14.2
A2_VOLUME_OUT
  Top 0.406: SJ3.1 104.11,10.89 VOL2.WIPER
AREF
  Top 0.406: IC9.20 96.6,65.6 97.15,66.15 C36.1
AUDIO_IN1  (via drill 0.5)
  Top 0.406: SJ7.1 v85.01,30 v85,30 | v84,9 83.89,9.11 SJ1.3
  Bottom 0.406: v85,30 83,30 77,24 77,18 80,15 80,13 v84,9
AUDIO_IN2
  Top 0.406: SJ3.3 108.21,9.11 109,9.9 109,13 94.3,27.7 SJ6.1
D+  (via drill 0.5)
  Top 0.305: R28.2 37.65,55.2 41.7,55.2 42.15,54.75 IC7.37
  Top 0.406: R31.1 v37,24 | X1.3 9.96,49 13,49 15,47 v21,47 25,43 Z1.1 | v37,49 35.5,49 | 35.5,49 v34,49 | R28.2 35.85,54.25 35.5,53.9 35.5,49
  Bottom 0.406: v37,24 v37,49 | v21,47 32,47 v34,49
D-  (via drill 0.5)
  Top 0.305: IC7.38 R27.2 39.65,54.25 v38.7,53.3
  Top 0.406: R30.1 36,28.15 v36,29 | X1.2 13.75,50.25 16,48 22,48 v24,46 25,45 Z2.1
  Bottom 0.406: v36,29 36,46 | v38.7,53.3 36,50.6 36,46 | 36,46 v24,46
DAC1_AB  (via drill 0.5)
  Top 0.305: v70.6,46.6 67.9,46.6 66.75,47.75 IC7.130
  Top 0.406: IC4.11 90.25,39.75 90.6,39.4 90.6,38.6 90,38 82,38 v80,36 | IC9.1 80.71,70.71 v81,71
  Bottom 0.406: v80,36 76,36 69,43 69,45.4 70.2,46.6 v70.6,46.6 76.6,46.6 82.1,52.1 82.1,56.8 83.9,58.6 83.9,70.1 83,71 v81,71 80.8,70.8
DAC1_DB0  (via drill 0.5)
  Top 0.305: IC4.8 82.07,41.07 v79,38 78,37 72,37 71,36 69,36 67.75,37.25 IC7.109
  Top 0.406: IC9.23 93.9,68 v94.1,68.2
  Bottom 0.406: v79,38 95.4,54.4 95.4,59.6 94,61 94,68.1 v94.1,68.2
DAC1_DB1  (via drill 0.5)
  Top 0.305: IC7.111 77.25,38.25 v77.5,38.5 80.73,41.73 IC4.7
  Top 0.406: IC9.24 92.8,68.8 v93,69
  Bottom 0.406: v93,69 93,61 94.6,59.4 94.6,54.6 79,39 78,39 v77.5,38.5
DAC1_DB2  (via drill 0.5)
  Top 0.305: IC7.113 76.25,39.25 v76.5,39.5 79.39,42.39 IC4.6
  Top 0.406: IC9.25 87.8,70.8 89,72 v90,72 | v91.5,59.7 92.5,58.7 v93.6,58.7
  Bottom 0.406: v76.5,39.5 77,40 79,40 93.6,54.6 v93.6,58.7 | v90,72 90,71 91,70 91,60.2 v91.5,59.7
DAC1_DB3  (via drill 0.5)
  Top 0.305: IC7.115 75.25,40.25 v75.5,40.5 78.05,43.05 IC4.5
  Top 0.406: IC9.26 87,72 v90,75
  Bottom 0.406: v90,75 91,74 91,71 92,70 92,61 92.5,60.5 92.5,54.5 79,41 76,41 v75.5,40.5
DAC1_DB4  (via drill 0.5)
  Top 0.305: IC7.117 74.25,41.25 v74.5,41.5 76.71,43.71 IC4.4
  Top 0.406: IC9.2 82,68 83.3,66.7 v87,66.7
  Bottom 0.406: v74.5,41.5 75,42 79,42 90.4,53.4 90.4,54.9 88.6,56.7 88.6,65.1 v87,66.7
DAC1_DB5  (via drill 0.5)
  Top 0.305: IC7.119 73.25,42.25 v73.5,42.5 75.37,44.37 IC4.3
  Top 0.406: IC9.9 82.2,59.4 86.6,55 87.6,55 v88.7,53.9
  Bottom 0.406: v73.5,42.5 74,43 79,43 88.7,52.7 v88.7,53.9
DAC1_DB6  (via drill 0.5)
  Top 0.305: IC7.121 72.25,43.25 v72.5,43.5 74.03,45.03 IC4.2
  Top 0.406: v86,56.9 83,59.9 IC9.10
  Bottom 0.406: v72.5,43.5 73,44 79,44 84.5,49.5 84.5,53.6 86,55.1 v86,56.9
DAC1_DB7  (via drill 0.5)
  Top 0.305: IC7.123 71.25,44.25 v71.5,44.5 72.69,45.69 IC4.1
  Top 0.406: IC9.11 83.8,62.7 v85.8,64.7
  Bottom 0.406: v71.5,44.5 72,45 79,45 83.6,49.6 83.6,56.2 85.8,58.4 v85.8,64.7
DAC1_VOUTA  (via drill 0.5)
  Top 0.406: IC4.19 88.94,45 92,45 94,43 94,39 89.61,34.61 v89.61,34 SJ5.3 | SJ4.3 94.19,34 v92,34
  Bottom 0.406: v89.61,34 v92,34
DAC1_VOUTB  (via drill 0.5)
  Top 0.406: IC4.18 91.63,44.37 93,43 93,39 87.79,33.79 v87.79,32 SJ7.3 | v92,32 92.29,32.29 SJ6.3
  Bottom 0.406: v87.79,32 v92,32
DAC1_WR  (via drill 0.5)
  Top 0.305: IC7.128 66.85,46.75 68.2,45.4 v70.6,45.4
  Top 0.406: v82,39 82.75,39.75 IC4.10 | IC9.32 82.2,68.8 83.1,67.9 v85.4,67.9
  Bottom 0.406: v82,39 80,37 76,37 70.6,42.4 v70.6,45.4 70.8,45.6 76.6,45.6 82.8,51.8 82.8,56.5 84.7,58.4 84.7,67.2 v85.4,67.9
DAC2_CS  (via drill 0.5)
  Top 0.305: IC7.95 57.25,36.95 v59.3,39
  Top 0.406: v99,47 v99,50 99,51 98,52 93.2,52 86.2,59 IC9.14 | IC1.2 101.33,53.08 v101,53.4 | v74,35 76,33 v77,33
  Bottom 0.305: v74,35 70,39 v59.3,39
  Bottom 0.406: v99,47 94.4,47 93.4,48 92,48 85,41 85,36.8 81.2,33 v77,33 | v101,53.4 99,51.4 v99,50
DAC2_LDAC  (via drill 0.5)
  Top 0.305: IC7.93 56.25,37.35 v57.9,39
  Top 0.406: v94.7,48.5 93.5,48.5 90,52 v85.5,52 82.3,48.8 79.8,48.8 78.5,47.5 v73.8,47.5 | IC9.13 85.4,63 86.1,63.7 v87,63.7 | v99,40.8 IC1.5
  Bottom 0.406: v94.7,48.5 99.5,48.5 100.1,47.9 100.1,46.1 99,45 v99,40.8 | v85.5,52 85.4,52.1 85.4,53.4 87,55 v87,63.7 | v57.9,39 59.9,41 63,41 69.5,47.5 v73.8,47.5
DAC2_VOUT
  Top 0.406: 102,40.77 IC1.8 101.97,39.88 100.1,38 96,38 94.3,36.3 SJ4.1 91.99,35.89 90.8,34.7 90.8,31.3 91.39,30.71 SJ5.1
DTR  (via drill 0.5)
  Top 0.406: v14,24 14.4,23.6 IC8.13 | UBOOT.1 14,37.76 v14,36
  Bottom 0.406: v14,24 v14,36
FWUP
  Top 0.305: IC7.135 72,50.25 R8.2
GND  (via drill 0.5)
  Top 0.305: IC7.60 42.25,43.25 42,43 | IC7.33 47.75,58.75 v49,60 54,60 55.25,58.75 IC7.18 | v51,66 Y1.2 | C26.2 54.15,68.8 47.55,68.8 C25.2 | IC7.75 47.25,31.4 C23.2 47.5,30.35 C24.- | v47.54,27 44,27 42,29 42,43 | 41,42 35,42 33,44 33,46 34.25,47.25 42.5,47.25 | 41,42 42,43 | 42.5,47.25 IC7.52 | 28.5,39.5 38.5,39.5 41,42 | IC7.43 43.35,51.75 42.5,50.9 42.5,47.25 | IC7.126 63.65,45.75 v61.9,47.5 | 51,27.05 v51,27 53,27 56,30 56,32.7 54.75,33.95 IC7.90 | 76.4,55 v75.5,54.1 | v61.9,51.5 62.6,51.5 63.85,52.75 IC7.140
  Top 0.406: ICSP1.6 5.73,18.76 S2.4 S2.3 | IC9.18 94.5,64 95.5,63 C38.2 | C36.2 98.85,65.85 v98,65 97.15,64.15 C38.2 | C38.2 C37.2 97,58.85 97,57 96.5,56.5 C39.- | C22.2 C21.1 | v33.54,20.46 30.4,23.6 IC8.28 22.8,23.6 22.2,24.2 IC8.3 22.2,29.8 20.7,31.3 18.2,31.3 C35.- | POT1.CCW 21.54,15 31.54,15 POT3.CCW | C8.2 87.5,49.15 C9.- 87.5,46.3 | 87.5,46.3 88.11,45.69 IC4.20 93.39,45.69 94.9,47.2 96.8,47.2 97,47 | 87.5,46.3 87.5,44.2 87.99,43.71 IC4.17 89.79,43.71 90.25,43.25 | IC4.13 89.67,41.07 90.25,41.65 90.25,43.25 | IC4.9 85.29,40.41 v86.7,39 | v91.3,42.6 90.9,42.6 90.25,43.25 | IC1.7 101.33,42.88 100.35,43.85 C1.1 97,44.85 97,47 | C17.2 R26.2 82.3,13.7 80,16 v77,16 | 97,47 97,48 v95,50 93,50 90,53 87.8,53 86.8,54 81,54 80,55 76.4,55 75,55 72.4,57.6 C31.2 71.65,59.35 71,60 71,67.4 71.85,68.25 C30.2 v72.4,69.4 75.7,72.7 | IC9.5 79.4,65.6 79,66 79,66.8 | 79,66.8 79.4,67.2 IC9.3 | v74.1,63.8 Y3.2 | S1.4 S1.3 S3.4 S3.3 64.93,77.26 ICSP2.6 69.49,72.7 75.7,72.7 | v66.2,63.9 Y2.2 | 64.15,68.15 C28.2 | 64.15,68.15 63,67 63,61.05 C27.2 | v66.2,68.8 64.8,68.8 64.15,68.15 | C35.- 16.5,33.5 | C35.- 14.65,33.5 C34.2 | v24.8,36.6 Y4.2 | C35.- 16,35.7 v16.4,36.1 18.3,38 C33.2 20.35,38.65 21.2,39.5 | 21.2,39.5 28.5,39.5 29.35,38.65 C32.2 | 79,66.8 79,70.6 76.9,72.7 75.7,72.7 | POT2.CCW v47.54,27 47.54,28.96 C24.- | C22.2 67,31 69.7,33.7 73.3,33.7 75,32 v78,32 81,32 84,29 C13.2 82.6,24.55 82.6,22.1 83.4,21.3 IC6.4 | JP1.2 51,25.19 v51,27 | 21.2,39.5 18.26,39.5 UBOOT.2 17.76,40.84 17,41.6 12.4,41.6 8.71,45.29 | C22.2 67,31.3 66.3,32 65,32 64,31 64,28 65,27 v68,27 v74,27 | v21,41 C29.1 | 8.71,45.29 X1.4 | 8.71,45.29 6,48 6,51 7.6,52.6 13.4,52.6 17,49 v23,49 25,47 L1.1
  Top 0.406: C4.- 33.35,55.5 C3.2 38.3,56.15 R24.2 C20.2 39.15,60.15 39.5,60.5 | IC2.2 C2.- | R2.1 R3.1 R4.1 8.85,71.15 9VDC_POWER.GND 3.7,59.3 5,58 9,58 11,60 17.5,60 IC2.2 | 30,62 C5.- | 30,62 v29,63 29,64.5 IC3.2 30.5,68 C7.- 30.5,74.35 C6.2 | IC2.2 20.5,59.5 v22,61 | 30,62 31.5,60.5 39.5,60.5 | 43,67 43,62 v45,60 44.5,60.5 39.5,60.5 | 43,67 v43,69 | C25.2 43.6,67.6 43,67 | 99,27 98.85,27 C12.2 | 99,27 101.3,27 102.1,27.8 IC5.4 102.1,31 v101.1,30 | R25.2 C16.2 107.1,26.1 106,25 101,25 99,27 | J2.1 97,6 93,6 | 93,6 92,7 92,10 93,11 97,11 98.46,12.46 VOL2.CCW | 72,6 J1.1 | VOL1.CCW 69,14 67,12 67,8 68,7 71,7 72,6 | 72,6 93,6
  Bottom 0.305: v51,66 48,63 48,60 | v47.54,27 v51,27 | v61.9,47.5 v61.9,51.5 63.2,50.2 73.5,50.2 75.5,52.2 v75.5,54.1
  Bottom 0.406: ICSP1.6 4,12.81 4,8 5,7 9,7 12,10 18,10 19.54,11.54 POT1.CCW | POT3.CCW v33.54,20.46 | v98,65 98,51 97,50 v95,50 | v45,60 48,60 v49,60 | 66.2,66 v66.2,68.8 | 66.2,66 v66.2,63.9 | v24.8,36.6 16.9,36.6 v16.4,36.1 21,40.7 v21,41 | 72.4,65.5 v74.1,63.8 | v72.4,69.4 72.4,65.5 | 72.4,65.5 71.9,66 66.2,66 | v68,27 67,26 67,16 64,13 POT4.CCW | v29,63 27,61 v22,61 22,50 v23,49 | v43,69 43,70.6 47.75,75.35 S1.4 | v78,32 81.3,32 86.7,37.4 v86.7,39 90.3,42.6 v91.3,42.6 92.4,42.6 101.1,33.9 v101.1,30 | VOL1.CCW 73,14 75,16 v77,16 74,19 v74,27
  pour Top (isolate 0.508): 0,81 113,81 113,0 0,0
  pour Bottom (isolate 0.508): 0,81 113,81 113,0 0,0
IC6
  Top 0.406: IC1.6 100.67,42.23 100.5,42.4 98.25,42.4 C1.2 R1.1
M8RXD  (via drill 0.5)
  Top 0.406: v47,43 v62,43 | v81,76 81,77 81.85,77.85 R33.1 | IC8.9 18,26.8 18.5,26.3 18.5,22.5 v19,22 | v79.5,52.4 79.25,52.65 R6.1 | v41,31 40,30 29,30 v28,29
  Bottom 0.406: v41,31 41,42 42,43 v47,43 | v81,76 80,76 78.5,74.5 78.5,72 80.5,70 81.9,70 83.2,68.7 83.2,59 81.4,57.2 81.4,54.3 v79.5,52.4 79.4,52.4 77,50 76.8,49.8 76,49 68,49 v62,43 | v19,22 25,22 28,25 v28,29
M8TXD  (via drill 0.5)
  Top 0.406: v49,44 v61,44 | v77,76 77,77 77.85,77.85 R35.1 | IC8.8 15.59,28.29 v15.4,28.1 | v40,32 39,31 28,31 v26,29 | R7.1 75.45,52.65 76.8,54 v79,54
  Bottom 0.406: v40,32 40,43 41,44 v49,44 | v15.4,28.1 20.5,23 24,23 26,25 v26,29 | v77,76 77,72.5 80.3,69.2 81.7,69.2 82.4,68.5 82.4,59.3 80.7,57.6 80.7,55.7 v79,54 74.6,49.6 66.6,49.6 v61,44
MISO1  (via drill 0.5)
  Top 0.406: IC9.16 87.8,60.2 v90,58 | ICSP2.1 74.93,76.67 78.6,73 v80,73
  Bottom 0.406: v80,73 81,72 87,72 89.4,69.6 89.4,58.6 v90,58
MISO2  (via drill 0.5)
  Top 0.406: v14,15 17,15 18.2,16.2 IC8.17
  Bottom 0.406: ICSP1.1 9.46,9.46 13,13 13,14 v14,15
MOSI1  (via drill 0.5)
  Top 0.305: IC7.88 53.75,37.75 v55,39
  Top 0.406: IC9.15 87,59.6 v91.2,55.4 93.6,53 98.5,53 100.03,51.48 IC1.4 | ICSP2.4 70.6,74.2 71.8,75.4 75.2,75.4 78.6,72 80.5,72 v81.5,73
  Bottom 0.406: v81.5,73 87,73 90.1,69.9 90.1,59.5 91.2,58.4 v91.2,55.4 | ICSP2.4 70.6,73.6 69,72 68,72 67.2,71.2 65.2,71.2 64.3,70.3 64.3,60.3 55,51 v55,39
MOSI2  (via drill 0.5)
  Top 0.406: ICSP1.4 7.03,13.3 11.3,13.3 v12,14 | v13,20 14.2,21.2 IC8.16
  Bottom 0.406: v12,14 12,19 v13,20
N$1
  Top 0.305: IC7.41 40.7,52.75 R27.1
N$2
  Top 0.305: IC7.42 42.55,52.25 41.9,51.6 37.65,51.6 R28.1
N$3
  Top 0.406: R37.2 RX.C
N$4
  Top 0.406: R36.2 TX.C
N$5  (via drill 0.5)
  Top 0.305: IC7.39 50.05,53.75 v51,52.8
  Top 0.406: R24.1 40.85,59 | 40.85,59 C20.1 | 40.85,59 v43,59
  Bottom 0.305: v43,59 43,57.9 46.9,54 49.8,54 v51,52.8
N$6
  Top 0.406: R2.2 RX1.C
N$7
  Top 0.305: IC7.133 76.15,49.25 77.7,50.8 R6.2
N$8
  Top 0.406: IC9.30 83.8,73.2 83,74 R33.2
N$9
  Top 0.406: IC9.31 83,73 82,74 80,74 79,75 R35.2
N$10
  Top 0.305: IC7.134 74.1,49.75 R7.2
N$11
  Top 0.406: D3.A 27.8,61 IC2.3 30.22,59.28 C4.+ 33.35,58.5 C3.1
N$12  (via drill 0.5)
  Top 0.305: IC7.9 59.75,57.75 59,58.5 57.9,58.5 v57.4,59
  Bottom 0.305: v57.4,59 57.4,59.6 59.1,61.3 59.1,68.6 TCK.1
N$14  (via drill 0.5)
  Top 0.305: IC7.4 62.25,57.55 v60.5,59.3
  Bottom 0.305: v60.5,59.3 63,61.8 63,64.7 TDO.1
N$15
  Top 0.406: R3.2 RX2.C
N$17
  Top 0.406: R4.2 RX3.C
N$18
  Top 0.406: R11.1 R12.2 C10.1 R9.1
N$19
  Top 0.406: IC5.3 100.88,32.77 100.5,32.4 100.5,31.1 99.95,30.55 R12.1 99.3,28.75 C12.1
N$20  (via drill 0.5)
  Top 0.406: R15.1 C14.1 v104.6,39.1 | v104.6,27.3 R16.2
  Bottom 0.406: v104.6,27.3 106,28.7 106,37.7 v104.6,39.1
N$21
  Top 0.406: R23.1 93.35,15.15 91.9,13.7 C19.+
N$22
  Top 0.406: 106.3,30.15 C16.1 | R16.1 106.3,30.15 | IC5.5 106.3,31.93 106.3,30.15
N$23
  Top 0.406: C18.+ 108.45,37.95 R22.1
N$24  (via drill 0.5)
  Top 0.305: IC7.142 67.75,53.75 v68.2,54.2
  Bottom 0.305: v68.2,54.2 69.9,55.9 71.8,55.9 JTAG.1
N$25
  Top 0.406: 9VDC_POWER.PWR 10.2,66 D2.A
N$26
  Top 0.406: SJ3.2 105,10 J2.5
N$27
  Top 0.406: IC2.1 27.8,53.8 26,52 C2.+ 23.5,51.3 22.9,50.7 19.3,50.7 14,56 D2.C
N$28
  Top 0.305: IC7.137 70.05,51.25 ERASE.1
N$29
  Top 0.406: SJ1.2 80,10 J1.5
N$69
  Top 0.406: R13.1 R14.2 C11.1 R10.1
N$71
  Top 0.406: IC6.3 88.28,22.32 88,22.6 86.6,22.6 86.2,23 86.2,23.85 R14.1 84.25,24 C13.1
N$73  (via drill 0.5)
  Top 0.406: R17.1 C15.1 v94.5,18.6 | R18.2 v82.6,18.6
  Bottom 0.406: v82.6,18.6 v94.5,18.6
N$74
  Top 0.406: 87.62,16.43 IC6.5 87.4,17.13 85.45,17.13 | C17.1 85.45,17.13 | 85.45,17.13 R18.1
NRSTB  (via drill 0.5)
  Top 0.305: v46.6,70 49.85,70 R5.1 | v56.7,54.2 v60.6,54.2 | v62.6,52.7 63.15,53.25 IC7.141
  Top 0.406: S1.1 S1.2
  Bottom 0.305: S1.1 55.79,71.2 62.5,71.2 63.6,70.1 63.6,61.1 v56.7,54.2 | v60.6,54.2 61.1,54.2 v62.6,52.7
  Bottom 0.406: 53.74,72.74 S1.1 50.74,72.74 48,70 v46.6,70
PA18
  Top 0.305: IC7.99 59.25,32.25 53.1,26.1 53.1,23.09 JP1.3
PA19
  Top 0.305: IC7.100 59.75,31.75 54.46,26.46 JP1.4
PA20
  Top 0.305: IC7.101 60.25,31.25 55.8,26.8 55.8,22.93 JP1.5
PA21
  Top 0.305: IC7.102 60.75,30.75 57,27 JP1.6
PA23
  Top 0.305: IC7.103 61.25,30.25 58.3,27.3 58.3,22.97 JP1.7
PA24
  Top 0.305: IC7.105 62.25,30.35 59.54,27.64 JP1.8
PA25
  Top 0.305: IC7.106 62.75,30.15 60.8,28.2 60.8,23.01 JP1.9
PA26
  Top 0.305: IC7.107 63.25,29.75 62.08,28.58 JP1.10
POT1  (via drill 0.5)
  Top 0.305: v35,44 37.75,46.75 IC7.53 47.95,46.75 v48,46.8
  Top 0.406: v26,19 v32,19 | IC9.27 86.2,73.2 89,76 92,76 v93,77
  Bottom 0.406: v35,44 35,24 32,21 v32,19 | POT1.WIPER 15,15 15,17 16,18 25,18 v26,19 | v93,77 91,79 47,79 46,78 46,75 41,70 41,50 44.2,46.8 v48,46.8
POT2  (via drill 0.5)
  Top 0.305: v38,45 38.75,45.75 IC7.55 57.55,45.75 v58.3,45
  Top 0.406: POT2.WIPER 43,15 v38,15 | v76.9,48.4 78.2,49.7 81.7,49.7 85,53 v86.4,53 | IC9.28 85.4,69.2 86.6,68 v87,68
  Bottom 0.406: v38,15 v38,45 | v58.3,45 61.3,42 63,42 69.4,48.4 v76.9,48.4 | v86.4,53 88,54.6 88,64 86,66 86,67 v87,68
POT3  (via drill 0.5)
  Top 0.305: IC7.57 39.75,44.75 v39,44
  Top 0.406: POT3.WIPER 33,11 37,11 v39,13 | IC9.19 95.2,64.8 v96,64
  Bottom 0.406: v39,44 v39,13 41,15 48,15 49.6,13.4 49.6,12.4 50,12 53,12 56.8,15.8 64.6,15.8 65.5,16.7 65.5,27.5 69.5,31.5 72.5,31.5 76,35 81,35 83,37 83,41 96,54 v96,64
POT4  (via drill 0.5)
  Top 0.305: POT4.WIPER 57,15 54,15 48.4,20.6 48.4,26.2 49.25,27.05 IC7.79
  Top 0.406: IC9.12 84.6,59.6 93.2,51 v96,51
  Bottom 0.406: v96,51 94,51 84,41 84,37 81,34 76,34 72.7,30.7 69.7,30.7 66.2,27.2 66.2,16.2 65,15 61,15 POT4.WIPER
RD+
  Top 0.406: IC8.29 32.6,24.4 33,24 R31.2
RD-
  Top 0.406: IC8.30 30.2,25.2 32,27 R30.2
RESET1
  Top 0.406: IC9.29 84.6,73.6 85,74 | 85,74 86,74 87,75 R29.1 | 85,74 85,78 84,79 70.39,79 ICSP2.5 | S3.2 S3.1
  Bottom 0.406: S3.2 57.75,73.75 59.6,75.6 65.1,75.6 66.17,76.67 ICSP2.5
RESET2  (via drill 0.5)
  Top 0.406: S2.2 8.27,18.76 ICSP1.5 | S2.2 S2.1 | S2.2 13.01,16 v16,16 | v23,16 23.8,16.8 23.8,17 | 23.8,17 IC8.24 | 23.8,17 R38.1
  Bottom 0.406: v16,16 v23,16
RXLED  (via drill 0.5)
  Top 0.406: IC8.10 14,26 v13,27 | v9,36 5,36 4.15,36.85 R37.1
  Bottom 0.406: v13,27 10,30 10,35 v9,36
SCK1  (via drill 0.5)
  Top 0.305: IC7.91 55.25,37.75 v56.5,39
  Top 0.406: IC9.17 93.8,63.2 v95,62 95,54.1 95.5,53.6 99.2,53.6 100.67,52.12 IC1.3 | v66,70.3 v66,72.3
  Bottom 0.406: v66,72.3 66,74 67.4,75.4 69.33,75.4 ICSP2.3 72.33,78.4 89.7,78.4 95,73.1 v95,62 | v56.5,39 56.5,51.5 65,60 65,69.3 v66,70.3
SCK2  (via drill 0.5)
  Top 0.406: v11,21 12,22 IC8.15
  Bottom 0.406: ICSP1.3 10,12 11,13 v11,21
TDI
  Top 0.305: IC7.1 63.75,58.25 62.1,59.9 62.1,62.6 TDI.1
TMS  (via drill 0.5)
  Top 0.305: IC7.7 60.75,57.55 v58.8,59.5
  Bottom 0.305: v58.8,59.5 59.6,60.3 59.6,67.5 TMS.1
TST  (via drill 0.5)
  Top 0.305: IC7.138 67.65,51.75 v68.2,52.3
  Bottom 0.305: v68.2,52.3 TST.1
TXLED  (via drill 0.5)
  Top 0.406: IC8.11 12.8,25.2 v12,26 | v9,32 5,32 4.15,32.85 R36.1
  Bottom 0.406: v12,26 9,29 v9,32
USBVCC  (via drill 0.5)
  Top 0.406: IC8.31 28,26 v29,27 | v28,10 29,9 48,9 51,12 v51,13 | v71.3,32.5 71.35,32.5 R21.1 | v22,44 F1.1 | v17,64 17.2,63.8 D1.A
  Bottom 0.406: v28,10 27,11 27,17 29,19 v29,27 29,29 30,30 32,30 33,31 33,40 32,41 25,41 v22,44 17,49 v17,64 | v51,13 52.7,13 56.2,16.5 64.2,16.5 64.8,17.1 64.8,27.8 69.5,32.5 v71.3,32.5
USHIELD
  Top 0.406: Z1.2 Z2.2 28.1,45.1 L1.2 28.1,47.6 27.6,48.1 25.9,48.1 24,50 18,50 13,55 X1.P$1 4,53 4,45 X1.P$2
VBUS
  Top 0.406: F1.2 12.3,47.75 X1.1
VBUS_DETECT  (via drill 0.5)
  Top 0.305: IC7.110 69.25,37.75 v70,37
  Top 0.406: R21.2 C21.2 C22.1 65.85,29.15 v65,30
  Bottom 0.406: v70,37 65,32 v65,30
VCC  (via drill 0.5)
  Top 0.305: 56,16 62,16 64,14 64,12 63,11 58.46,11 POT4.CW
  Top 0.406: ICSP1.2 6.97,10.7 12.16,10.7 POT1.CW 16.46,11 26.46,11 POT3.CW 31.46,10 39.46,10 POT2.CW | v31,28 28,28 26.8,26.8 IC8.32 24,26.8 23.3,26.1 v23.3,24.8 | R38.2 30.7,17 v30.85,17.15 | v20.8,24.8 21.4,25.4 IC8.4 21.4,29.6 20.5,30.5 C35.+ 14.65,30.5 C34.1 11.85,31.15 11,32 11,33.95 TX.A RX.A 12.05,39 v13,39 | IC4.15 IC4.14 | IC4.15 IC4.16 | 87,41.8 87,41 87.59,40.41 IC4.12 91.51,40.41 v91.6,40.5 | 87,41.8 87.6,42.4 88.9,42.4 IC4.15 | 87,41.8 84.5,44.3 C9.+ 84.5,49.15 C8.1 85.1,49.85 85.1,50.6 85.5,51 89,51 v93,47 | v95.5,46 R1.2 | IC6.8 89.58,18.12 88.4,19.3 87.5,19.3 86.5,20.3 83.3,20.3 81.6,22 81.6,28.4 v80,30 | 89,79 88.15,79 R29.2 | 89,79 v89,77 | v72.6,71.4 72,72 68,72 65,75 39.5,75 | IC9.6 82.2,64.8 83.2,65.8 | 83.2,65.8 87.5,65.8 88.1,66.4 IC9.21 95.4,66.4 96,67 96,70 97,71 100,71 | IC9.4 82.6,66.4 83.2,65.8 | v103,45 102.17,45 IC1.1 101.97,54.02 101,55 C39.+ 99.5,56.5 99,57 99,58.85 C37.1 C38.1 98.85,63.85 100,65 100,71 | v16,76 17.05,77.05 RX3.A | 39.5,75 v36,75 | SJ2.2 39.9,74.6 39.5,75 | JP1.1 51.92,20.08 56,16 | 89,79 97,79 100,76 100,71 | IC5.8 105.17,34.08 v104.3,33.2
  Bottom 0.406: POT3.CW 28.46,14.76 v30.85,17.15 31,17.3 v31,28 | v23.3,24.8 v20.8,24.8 | v93,47 94,46 v95.5,46 95.5,41.5 98.1,38.9 101.9,38.9 103,40 | v89,77 76.1,77 75.5,76.4 75.5,75.5 74,74 73.27,74 ICSP2.2 72.6,73.59 v72.6,71.4 | POT2.CW 44.46,11 54.46,11 POT4.CW 58.46,11 63,11 68,16 68,25.6 72,29.6 74.6,29.6 76,31 77,31 79,31 | v13,39 18,44 | 103,40 v103,45 | v36,75 17,75 v16,76 | v91.6,40.5 91.5,40.5 82,31 79,31 | v104.3,33.2 103,34.5 103,40 | 79,31 v80,30
VUCAP  (via drill 0.5)
  Top 0.406: IC8.27 29.2,22.8 v30,22 | v34,41 C29.2
  Bottom 0.406: v30,22 30,28.6 30.4,29 33,29 34,30 v34,41
XTAL1
  Top 0.406: 28.37,34.6 Y4.1 | 29,34.6 28.37,34.6 | 29,34.6 Q4.1 | 28.37,34.6 27.65,35.32 C32.1 R34.2 | IC8.1 23.8,29.4 29,34.6
XTAL2
  Top 0.406: Q4.2 21,34.6 | 21,34.6 21.22,34.6 | 21.22,34.6 Y4.3 | 21.22,34.6 22.05,35.43 C33.1 R34.1 | IC8.2 23,32.6 21,34.6
XTAL3
  Top 0.305: Q1.1 Y1.1 | C25.1 R19.2 | C25.1 48,67.65 | Q1.1 48.05,65.8 C25.1 | IC7.36 Q1.1
XTAL4
  Top 0.305: 54,64 Q1.2 53.65,66.1 C26.1 R19.1 | 54,64 Y1.3 52,63 50,61 48.6,61 46.75,59.15 IC7.35 | 54,64 53.65,63.65
XTAL5
  Top 0.406: 76.4,67.8 Q3.1 | R32.2 C30.1 75.15,66.55 76.4,67.8 | IC9.7 79,64 78,65 78,66 77,67 76.4,67 | 76.4,67.8 76.4,67 | 76.4,67 Y3.1
XTAL6
  Top 0.406: R32.1 C31.1 74.4,61.05 Q3.2 76.4,60 | 76.4,60 Y3.3 | IC9.8 79.6,63.2 76.4,60
XTAL7
  Top 0.305: IC7.144 66.75,54.75 68,56 68,59.8 68.2,60
  Top 0.406: Y2.1 68.2,60 Q2.1 66.1,61.15 C27.1 R20.2
XTAL8
  Top 0.305: IC7.143 67.05,54.25 68.6,55.8 69.3,55.8 69.7,56.2 69.7,65.5 68.2,67
  Top 0.406: Y2.3 68.2,67 Q2.2 66.1,66.45 C28.1 R20.1

### Text on the board
tNames: synth-a-phone v1.0 | audio.synth.dev
bNames: audio.synth.dev | synth-a-phone v1.0